# Altium project LightLink_V3.PrjPcb
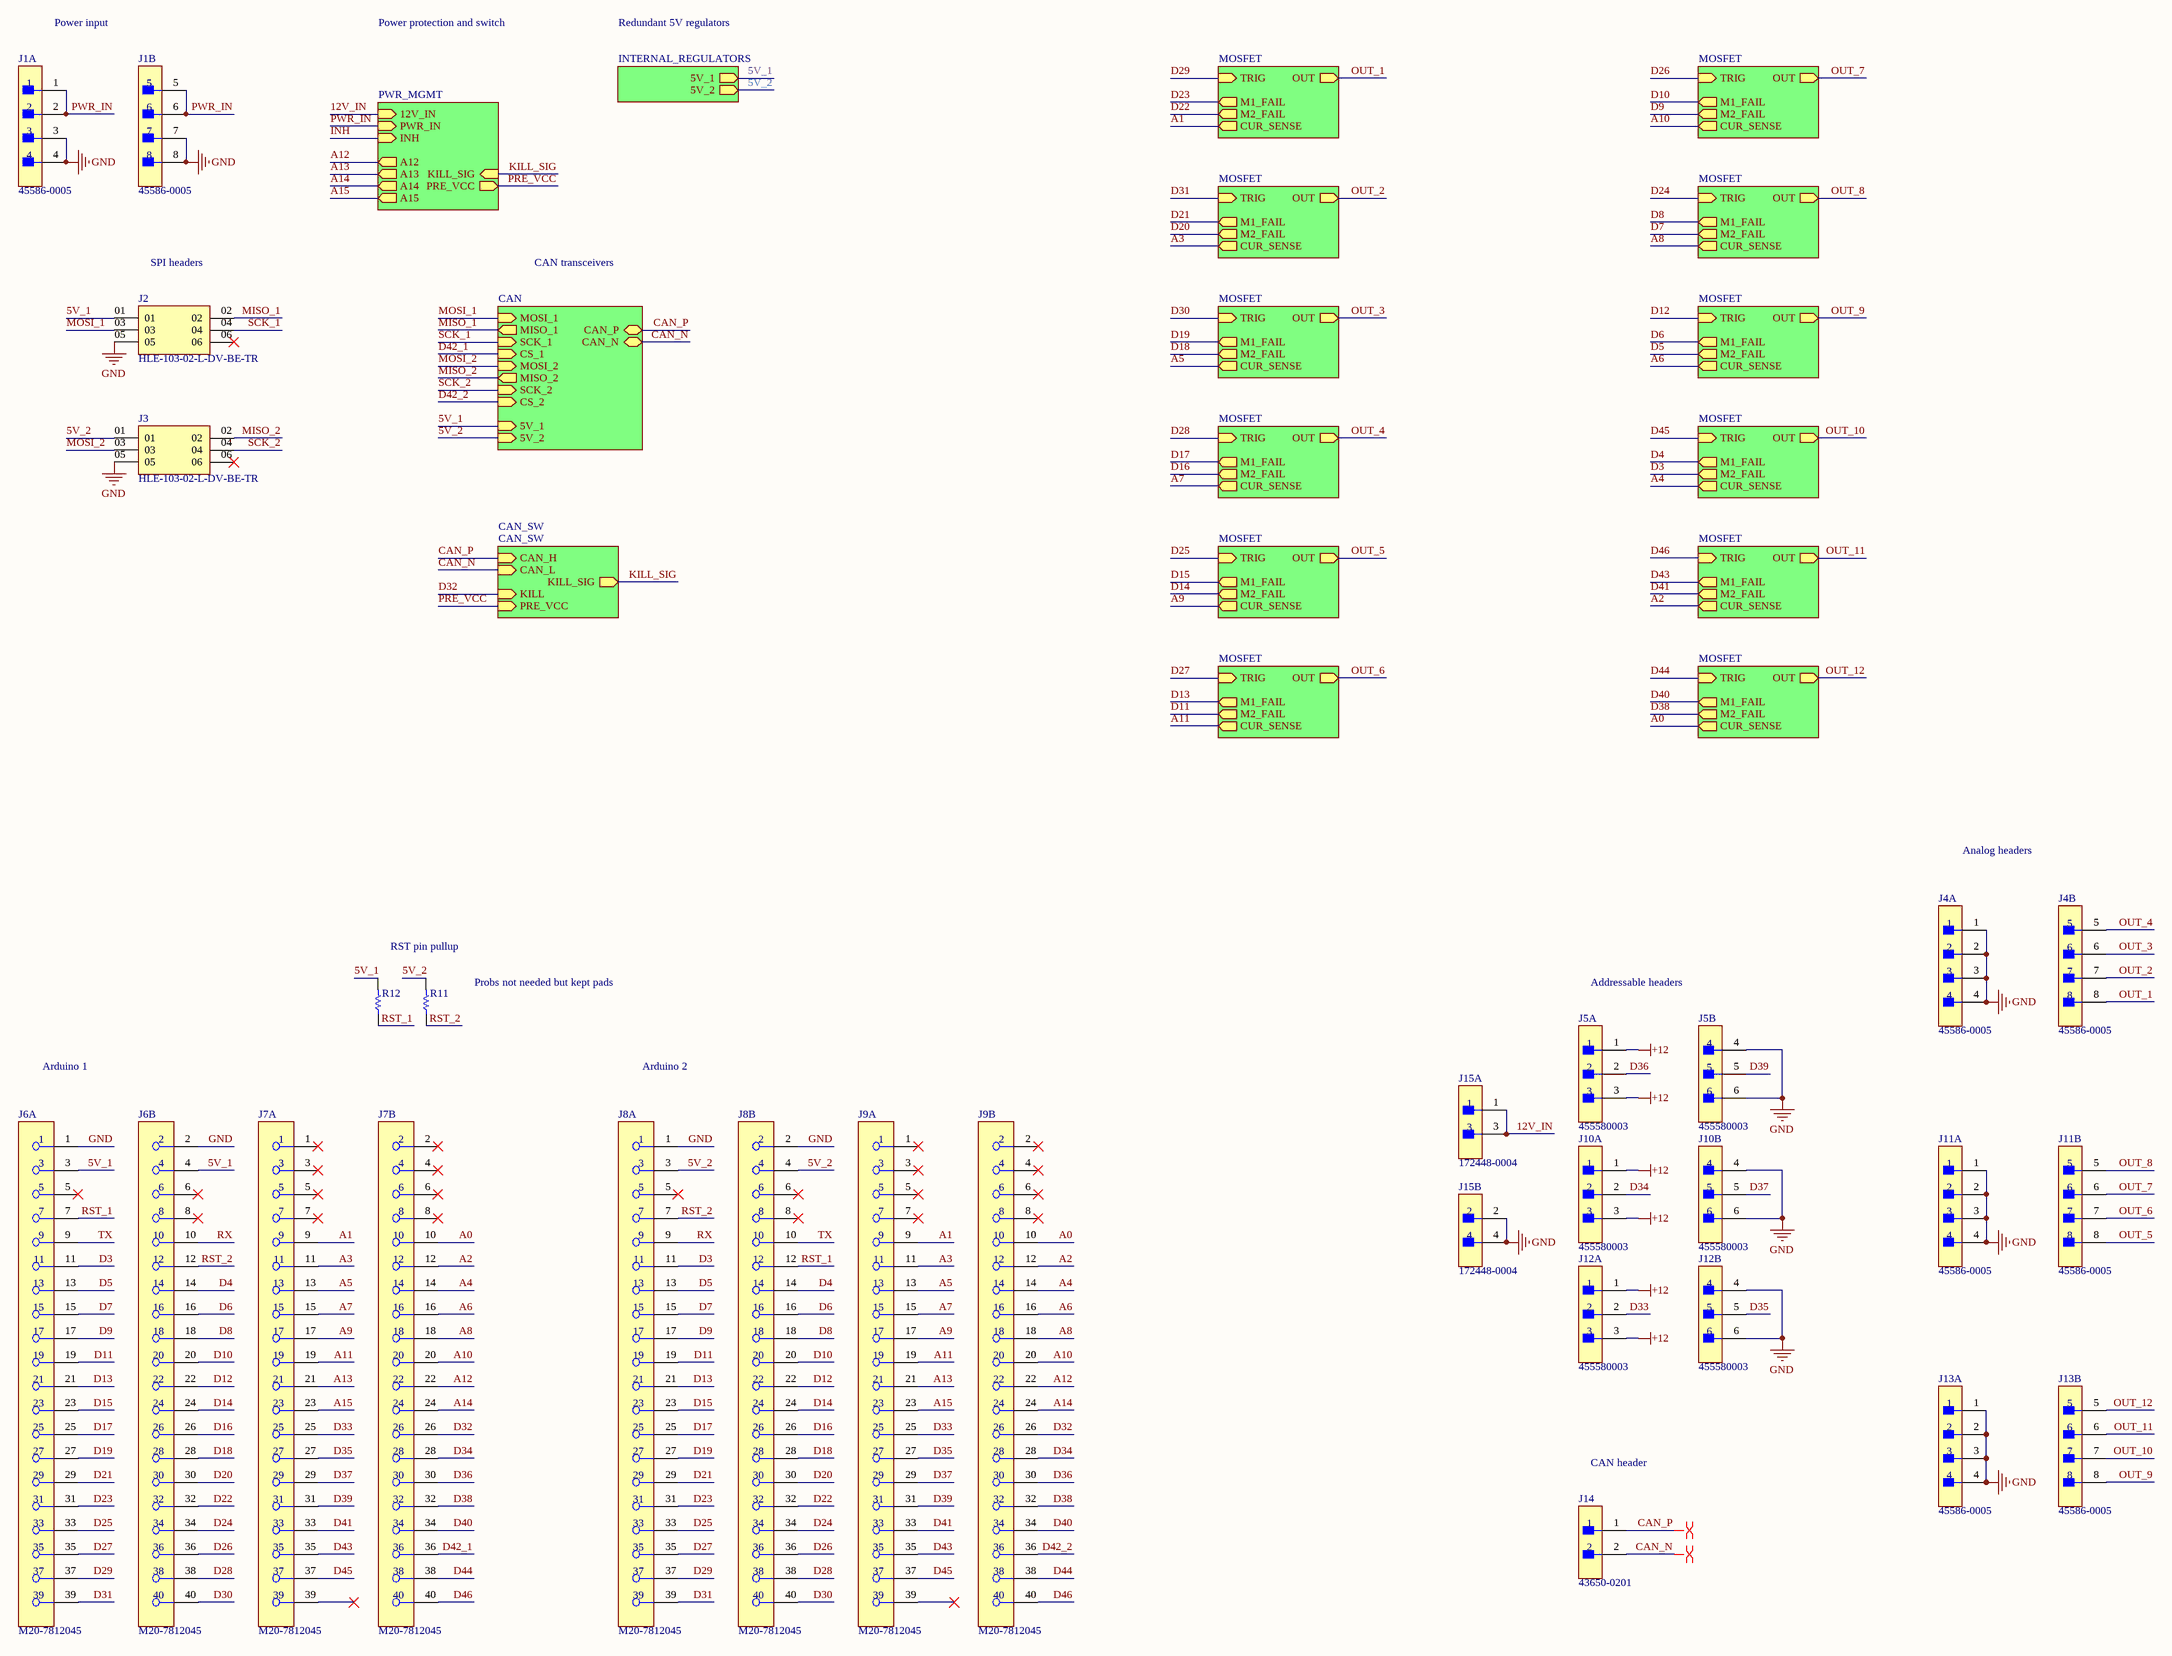
[diagram p0: LightLink_V3.SchDoc]
5 sheets, 346 parts. Net scope: hierarchical (ports join the sheet entries above them; power ports are global).
Board file: LightLink_V3.PcbDoc
Sheets:
  LightLink_V3.SchDoc
    M = MOSFET.SchDoc
    M = MOSFET.SchDoc
    M = MOSFET.SchDoc
    M = MOSFET.SchDoc
    M = MOSFET.SchDoc
    M = MOSFET.SchDoc
    M = MOSFET.SchDoc
    M = MOSFET.SchDoc
    M = MOSFET.SchDoc
    M = MOSFET.SchDoc
    M = MOSFET.SchDoc
    M = MOSFET.SchDoc
    CAN = CAN.SchDoc
    INTERNAL_REGULATORS = INTERNAL_REGULATORS.SchDoc
    CAN_SW = CAN_SW.SchDoc

## Sheet LightLink_V3.SchDoc
size C; SheetNumber: 1; SheetTotal: 6

### Parts
J1  45586-0005  [FP-45586-0005-MFG]  (parts A,B of 2)
J2  HLE-103-02-L-DV-BE-TR  [SAMTEC_HLE-103-02-L-DV-BE-TR]
J3  HLE-103-02-L-DV-BE-TR  [SAMTEC_HLE-103-02-L-DV-BE-TR]
J4  45586-0005  [FP-45586-0005-MFG]  (parts A,B of 2)
J5  455580003  [FP-455580003-MFG]  (parts A,B of 2)
J6  M20-7812045  [FP-M20-7812045-MFG]  (parts A,B of 2)
J7  M20-7812045  [FP-M20-7812045-MFG]  (parts A,B of 2)
J8  M20-7812045  [FP-M20-7812045-MFG]  (parts A,B of 2)
J9  M20-7812045  [FP-M20-7812045-MFG]  (parts A,B of 2)
J10  455580003  [FP-455580003-MFG]  (parts A,B of 2)
J11  45586-0005  [FP-45586-0005-MFG]  (parts A,B of 2)
J12  455580003  [FP-455580003-MFG]  (parts A,B of 2)
J13  45586-0005  [FP-45586-0005-MFG]  (parts A,B of 2)
J14  43650-0201  [FP-43650-0201-MFG]
J15  172448-0004  [FP-39-30-1041-MFG]  (parts A,B of 2)
R11  ERJ3EKF1002V  [RESC1609X55X30LL15T15]  (value not drawn)
R12  ERJ3EKF1002V  [RESC1609X55X30LL15T15]  (value not drawn)

### Sub-sheets
CAN = CAN: CAN_P (bidir), CAN_N (bidir), CS_1 (in), CS_2 (in), MOSI_1 (in), MISO_1 (out), SCK_1 (in), MOSI_2 (in), MISO_2 (out), SCK_2 (in), 5V_1 (in), 5V_2 (in)
CAN_SW = CAN_SW: CAN_H (in), CAN_L (in), KILL (in), KILL_SIG (out), PRE_VCC (in)
INTERNAL_REGULATORS = INTERNAL_REGULATORS: 5V_1 (out), 5V_2 (out)
M = MOSFET: TRIG (in), OUT (out), M2_FAIL (out), M1_FAIL (out), CUR_SENSE (out)
M = MOSFET: TRIG (in), OUT (out), M2_FAIL (out), M1_FAIL (out), CUR_SENSE (out)
M = MOSFET: TRIG (in), OUT (out), M2_FAIL (out), M1_FAIL (out), CUR_SENSE (out)
M = MOSFET: TRIG (in), OUT (out), M2_FAIL (out), M1_FAIL (out), CUR_SENSE (out)
M = MOSFET: TRIG (in), OUT (out), M2_FAIL (out), M1_FAIL (out), CUR_SENSE (out)
M = MOSFET: TRIG (in), OUT (out), M2_FAIL (out), M1_FAIL (out), CUR_SENSE (out)
M = MOSFET: TRIG (in), OUT (out), M2_FAIL (out), M1_FAIL (out), CUR_SENSE (out)
M = MOSFET: TRIG (in), OUT (out), M2_FAIL (out), M1_FAIL (out), CUR_SENSE (out)
M = MOSFET: TRIG (in), OUT (out), M2_FAIL (out), M1_FAIL (out), CUR_SENSE (out)
M = MOSFET: TRIG (in), OUT (out), M2_FAIL (out), M1_FAIL (out), CUR_SENSE (out)
M = MOSFET: TRIG (in), OUT (out), M2_FAIL (out), M1_FAIL (out), CUR_SENSE (out)
M = MOSFET: TRIG (in), OUT (out), M2_FAIL (out), M1_FAIL (out), CUR_SENSE (out)
PWR_MGMT = PWR_MGMT (file not in this document): PWR_IN (in), INH (in), A13 (out), A12 (out), PRE_VCC (out), KILL_SIG (in), A14 (out), A15 (out), 12V_IN (in)

### Nets
+12: J5.1 J5.3 J10.1 J10.3 J12.1 J12.3
GND: J1.3 J1.4 J1.7 J1.8 J2.05 J3.05 J4.1 J4.2 J4.3 J4.4 J5.4 J5.6 J6.1 J6.2 J8.1 J8.2 J10.4 J10.6 J11.1 J11.2 J11.3 J11.4 J12.4 J12.6 J13.1 J13.2 J13.3 J13.4 J15.2 J15.4
5V_1: J2.01 J6.3 J6.4 R12.2 ; sheet CAN/5V_1, sheet INTERNAL_REGULATORS/5V_1
5V_2: J3.01 J8.3 J8.4 R11.2 ; sheet CAN/5V_2, sheet INTERNAL_REGULATORS/5V_2
12V_IN: J15.1 J15.3 ; sheet PWR_MGMT/12V_IN
A0: J7.10 J9.10 ; sheet M/CUR_SENSE
A1: J7.9 J9.9 ; sheet M/CUR_SENSE
A2: J7.12 J9.12 ; sheet M/CUR_SENSE
A3: J7.11 J9.11 ; sheet M/CUR_SENSE
A4: J7.14 J9.14 ; sheet M/CUR_SENSE
A5: J7.13 J9.13 ; sheet M/CUR_SENSE
A6: J7.16 J9.16 ; sheet M/CUR_SENSE
A7: J7.15 J9.15 ; sheet M/CUR_SENSE
A8: J7.18 J9.18 ; sheet M/CUR_SENSE
A9: J7.17 J9.17 ; sheet M/CUR_SENSE
A10: J7.20 J9.20 ; sheet M/CUR_SENSE
A11: J7.19 J9.19 ; sheet M/CUR_SENSE
A12: J7.22 J9.22 ; sheet PWR_MGMT/A12
A13: J7.21 J9.21 ; sheet PWR_MGMT/A13
A14: J7.24 J9.24 ; sheet PWR_MGMT/A14
A15: J7.23 J9.23 ; sheet PWR_MGMT/A15
CAN_N: J14.2 ; sheet CAN/CAN_N, sheet CAN_SW/CAN_L
CAN_P: J14.1 ; sheet CAN/CAN_P, sheet CAN_SW/CAN_H
D3: J6.11 J8.11 ; sheet M/M2_FAIL
D4: J6.14 J8.14 ; sheet M/M1_FAIL
D5: J6.13 J8.13 ; sheet M/M2_FAIL
D6: J6.16 J8.16 ; sheet M/M1_FAIL
D7: J6.15 J8.15 ; sheet M/M2_FAIL
D8: J6.18 J8.18 ; sheet M/M1_FAIL
D9: J6.17 J8.17 ; sheet M/M2_FAIL
D10: J6.20 J8.20 ; sheet M/M1_FAIL
D11: J6.19 J8.19 ; sheet M/M2_FAIL
D12: J6.22 J8.22 ; sheet M/TRIG
D13: J6.21 J8.21 ; sheet M/M1_FAIL
D14: J6.24 J8.24 ; sheet M/M2_FAIL
D15: J6.23 J8.23 ; sheet M/M1_FAIL
D16: J6.26 J8.26 ; sheet M/M2_FAIL
D17: J6.25 J8.25 ; sheet M/M1_FAIL
D18: J6.28 J8.28 ; sheet M/M2_FAIL
D19: J6.27 J8.27 ; sheet M/M1_FAIL
D20: J6.30 J8.30 ; sheet M/M2_FAIL
D21: J6.29 J8.29 ; sheet M/M1_FAIL
D22: J6.32 J8.32 ; sheet M/M2_FAIL
D23: J6.31 J8.31 ; sheet M/M1_FAIL
D24: J6.34 J8.34 ; sheet M/TRIG
D25: J6.33 J8.33 ; sheet M/TRIG
D26: J6.36 J8.36 ; sheet M/TRIG
D27: J6.35 J8.35 ; sheet M/TRIG
D28: J6.38 J8.38 ; sheet M/TRIG
D29: J6.37 J8.37 ; sheet M/TRIG
D30: J6.40 J8.40 ; sheet M/TRIG
D31: J6.39 J8.39 ; sheet M/TRIG
D32: J7.26 J9.26 ; sheet CAN_SW/KILL
D33: J7.25 J9.25 J12.2
D34: J7.28 J9.28 J10.2
D35: J7.27 J9.27 J12.5
D36: J5.2 J7.30 J9.30
D37: J7.29 J9.29 J10.5
D38: J7.32 J9.32 ; sheet M/M2_FAIL
D39: J5.5 J7.31 J9.31
D40: J7.34 J9.34 ; sheet M/M1_FAIL
D41: J7.33 J9.33 ; sheet M/M2_FAIL
D42_1: J7.36 ; sheet CAN/CS_1  [project net CS_1]
D42_2: J9.36 ; sheet CAN/CS_2  [project net CS_2]
D43: J7.35 J9.35 ; sheet M/M1_FAIL
D44: J7.38 J9.38 ; sheet M/TRIG
D45: J7.37 J9.37 ; sheet M/TRIG
D46: J7.40 J9.40 ; sheet M/TRIG
INH: sheet PWR_MGMT/INH
KILL_SIG: sheet PWR_MGMT/KILL_SIG, sheet CAN_SW/KILL_SIG
MISO_1: J2.02 ; sheet CAN/MISO_1
MISO_2: J3.02 ; sheet CAN/MISO_2
MOSI_1: J2.03 ; sheet CAN/MOSI_1
MOSI_2: J3.03 ; sheet CAN/MOSI_2
OUT_1: J4.8 ; sheet M/OUT
OUT_2: J4.7 ; sheet M/OUT
OUT_3: J4.6 ; sheet M/OUT
OUT_4: J4.5 ; sheet M/OUT
OUT_5: J11.8 ; sheet M/OUT
OUT_6: J11.7 ; sheet M/OUT
OUT_7: J11.6 ; sheet M/OUT
OUT_8: J11.5 ; sheet M/OUT
OUT_9: J13.8 ; sheet M/OUT
OUT_10: J13.7 ; sheet M/OUT
OUT_11: J13.6 ; sheet M/OUT
OUT_12: J13.5 ; sheet M/OUT
PRE_VCC: sheet PWR_MGMT/PRE_VCC, sheet CAN_SW/PRE_VCC
PWR_IN: J1.1 J1.2 J1.5 J1.6 ; sheet PWR_MGMT/PWR_IN
RST_1: J6.7 J8.12 R12.1
RST_2: J6.12 J8.7 R11.1
RX: J6.10 J8.9
SCK_1: J2.04 ; sheet CAN/SCK_1
SCK_2: J3.04 ; sheet CAN/SCK_2
TX: J6.9 J8.10

Not connected (* = marked no-connect by the designer): J2 06*; J3 06*; J6 5* 6* 8*; J7 1* 2* 3* 4* 5* 6* 7* 8* 39*; J8 5* 6* 8*; J9 1* 2* 3* 4* 5* 6* 7* 8* 39*

### Layout directives
differential pair: CAN_N, CAN_P

### Notes on the sheet
- Power input
- Power protection and switch
- Redundant 5V regulators
- SPI headers
- CAN transceivers
- Analog headers
- RST pin pullup
- Probs not needed but kept pads
- Addressable headers
- Arduino 1
- Arduino 2
- CAN header

### Library data of the parts
J1 J4 J11 J13 = CMP-04776-000690-1: CONN HEADER R/A 8POS 4.2MM
J2 J3 = CMP-020-000000-2: MF: Samtec; Availability: Unavailable; Package: None; Component Type: Standard; MP: HLE-103-02-L-DV-BE-TR; Pin Count: 6; Design Item ID: HLE-103-02-L-DV-BE-TR; Value: *; Price: None; Source: HLE-103-02-L-DV-BE-TR.SchLib
J5 J10 J12 = CMP-04776-000024-1: CONN HEADER R/A 6POS 4.2MM; Manufacturer: Molex; Standoff Height: 0.4mm; Conn Orientation: Right Angle; Number Of Contacts: 6; Conn Gender: Male; Voltage Rating: 600V; Current Rating: 8A; Footprint Url: https://www.molex.com/pdm_docs/sd/455580003_sd.pdf; Number Of Rows: 2; Lead Free: Yes; Digikey Description: CONN HEADER R/A 6POS 4.2MM; ComponentLink2URL: https://www.molex.com/webdocs/datasheets/pdf/en-us/0455580003_PCB_HEADERS.pdf; Octopart: https://octopart.com/45558-0003-molex-7672845; Package: 0; Device Class L3: unset; ComponentLink2Description: Datasheet; Device Class L2: Headers and Wire Housings; Category: Conn; Contact Material: Tin,Nickel; Mouser Description: Conn Power HDR 6 POS 4.2mm Solder ST Thru-Hole 6 Terminal 1 Port Mini-Fit Jr™ Tray; Manufacturer Part Number: 455580003; Pitch: 4.2mm; Device Class L1: Connectors; Temperature Range Low: -40°C; Temperature: -40°C to +105°C; RoHS: TRUE; Temperature Range High: +105°C; Height: 10.38mm; Automotive: No
J6-J9 = CMP-15831-000026-1: CONN RCPT 40POS 0.1 GOLD SMD; Current Rating: 3A; Number of Positions: 40; Connector Type: Receptacle; Max Operating Temperature: 105°C; Flammability Rating: UL94 V-0; Contact Material: Bronze; Number of Rows: 2; Fastening Type: Push; Insulation Color: Black; Mount: Surface Mount; Contact Shape: Square; Termination: Solder; Packaging: Rail/Tube; Contact Plating: Gold; Min Operating Temperature: -40°C; Insulation Material: Nylon
J14 = CMP-04776-000557-1: CONN HEADER R/A 2POS 3MM; Voltage Rating: 600V; Number of Circuits: 2; Insulation Resistance: 1GR; Current Rating: 5A; Voltage Rating (DC): 250V; Contact Resistance: 10mR; Gender: Male; Number of Ports: 1; Glow Wire Compliant: Compliant; Pitch: 3mm; Contact Plating: Gold; Series: 43650; Color: Black; Max Operating Temperature: 105°C; Radiation Hardening: No; Orientation: Right Angle; Number of Terminals/Pins: 2; Length: 9.65mm; Case/Package: 0201; Halogen Free: Low Halogen; Housing Color: Black; Min Operating Temperature: -40°C; Package Quantity: 3927; Contact Material: Brass; Number of Rows: 1; Number of Positions: 2; Termination: Solder; Depth: 9.9mm; Mount: Through Hole; Packaging: Tray; Number of Contacts: 2; Housing Material: Thermoplastic; Flammability Rating: UL94 V-0
J15 = CMP-04776-000047-1: Different component but holes should line up. Original P/N is 39-30-1041; Manufacturer: Molex; Old_Part_Number: 5569-04A2G; Keying_to_Mating_Part: None; Circuits_maximum: 4; First_Mate__Last_Break: No; Lead_freeProcess_Capability: WAVE; Duration_at_Max_Process_Temperature_seconds: 005; Sales_Drawing: SDA-5569-NA2*-*; Current Rating: 13A; Material___Plating_Mating: Gold; Conn Gender: Male; Test_Summary: TS-5556-002; Color___Resin: Natural; Termination_Interface_Style: Through Hole; Pitch___Termination_Interface: 4.20mm; UL: E29179; PCB_Retention: Yes; Product_Name: Mini-Fit Jr.TM; Material___Resin: Nylon; Overview: Mini-Fit Jr. Power Connectors; CSA: LR19980; Plating_min___Termination: 2.540μm; Packaging_Type: Bag; Number_of_Rows: 2; Durability_mating_cycles_max: 30; Max_Cycles_at_Max_Process_Temperature: 001; Product_Specification: PS-45750-001, PS-5556-001; Net_Weight: 1.529/g; Voltage___Maximum: 600V; Material___Metal: Brass; Pitch: 4.2mm; Packaging_Specification: PK-5569-002; Shrouded: Fully; Plating_min___Mating: 0.762μm; Temperature_Range___Operating: -40°C to +105°C; Current___Maximum_per_Contact: 13.0A; Comments: Current = 13A max. per circuit when header is mated to a receptacle loaded with  45750  Mini-Fit® Plus HCS Crimp Terminal Crimped to 16 AWG wire.,  See Molex Product specification PS-5556-001 for additional current de-rating information.; Process_Temperature_max_C: 240; PCB_Thickness___Recommended: 1.78mm; Standoff Height: 0.016inch; Surface_Mount_Compatible_SMC: No; UPC: 800753579651; Conn Orientation: Right Angle; Material___Plating_Termination: Matte Tin; ComponentLink2Description: Datasheet; Footprint Url: https://www.molex.com/pdm_docs/sd/039301041_sd.pdf; Contact Material: Gold,Nickel; Octopart: https://octopart.com/39-30-1041-molex-276737; Digikey Description: CONN HEADER R/A 4POS 4.2MM; imported: yes; Series: 5569; Mouser Description: Headers & Wire Housings 4 CKT R/A HEADER; Temperature Range High: +105°C; Category: Conn; Polarized_to_Mating_Part: Yes; Pitch___Mating_Interface: 4.20mm; Automotive: No; Guide_to_Mating_Part: No; Lock_to_Mating_Part: Yes; Number Of Contacts: 4; Temperature Range Low: -40°C; RoHS: TRUE; Status: Active; imported_from: 3D Model; ComponentLink2URL: http://www.molex.com/pdm_docs/sd/039301041_sd.pdf; part_page: http://www.molex.com/molex/products/datasheet.jsp?part=active/0039301041_PCB_HEADERS.xml; Temperature: -40°C to +105°C; Device Class L3: unset; Device Class L1: Connectors; Package: 39-30-1041; Circuits_Loaded: 4; Lead Free: Yes; Ipc Land Pattern Name: CAPAD1016W80L630D240; Application: Power, Wire-to-Board; Voltage Rating: 600V; Manufacturer Part Number: 39-30-1041; Breakaway: No; Orientation: Right Angle; Flammability: 94V-2; 3D_model: http://www.molex.com/pdm_docs/stp/39-30-1041_stp.zip; Number Of Rows: 2; Polarized_to_PCB: Yes; Device Class L2: Headers and Wire Housings; Glow_Wire_Compliant: No; Stackable: No; PCB_Locator: Yes
R11 R12 = CMP-1012-00623-3: Chip Resistor, 10 KOhm, +/- 1%, 0.1 W, -55 to 155 degC, 0603 (1608 Metric), RoHS, Tape and Reel; Manufacturer: Panasonic; Voltage Rating: 75V; Case\/Package: 0603; Power Rating: 100mW; Resistance: 10KOhm; Temperature Coefficient: 100ppm\/degreesC; Number of Pins: 2; Package Reference: 603; Depth: 0.8mm; Mount: SurfaceMount; Package Description: 2-Pin Surface Mount Device, Body 1.6 x 0.85 mm; Datasheet Version: 02/2017; Length: 1.6mm; Lead Free: LeadFree; Height: 0.45mm; Number of Terminations: 2; Max Power Dissipation: 100mW; Min Operating Temperature: -55degC; Datasheet URL: https://industrial.panasonic.com/cdbs/www-data/pdf/RDA0000/AOA0000C304.pdf; Termination: SMD/SMT; Case Code (Metric): 1608; Case Code (Imperial): 0603; Tolerance: 1%; Max Operating Temperature: 155degC; RoHSCompliant: true; Voltage Rating (DC): 75V; Radiation Hardening: No; Packaging: TapeandReel; Composition: ThickFilm; Mounting Technology: SurfaceMount; Manufacturer URL: http://www.panasonic.com/; Width: 0.031inch; REACH SVHC: NoSVHC; Contact Plating: Tin; Military Standard: Not; Package Quantity: 1

## Sheet MOSFET.SchDoc
size B; SheetNumber: 2; SheetTotal: 6
Used 12 times, as channels M, M, M, M, M, M, M, M, M, M, M, M. Parts and nets are listed once, with the designators drawn on the sheet.
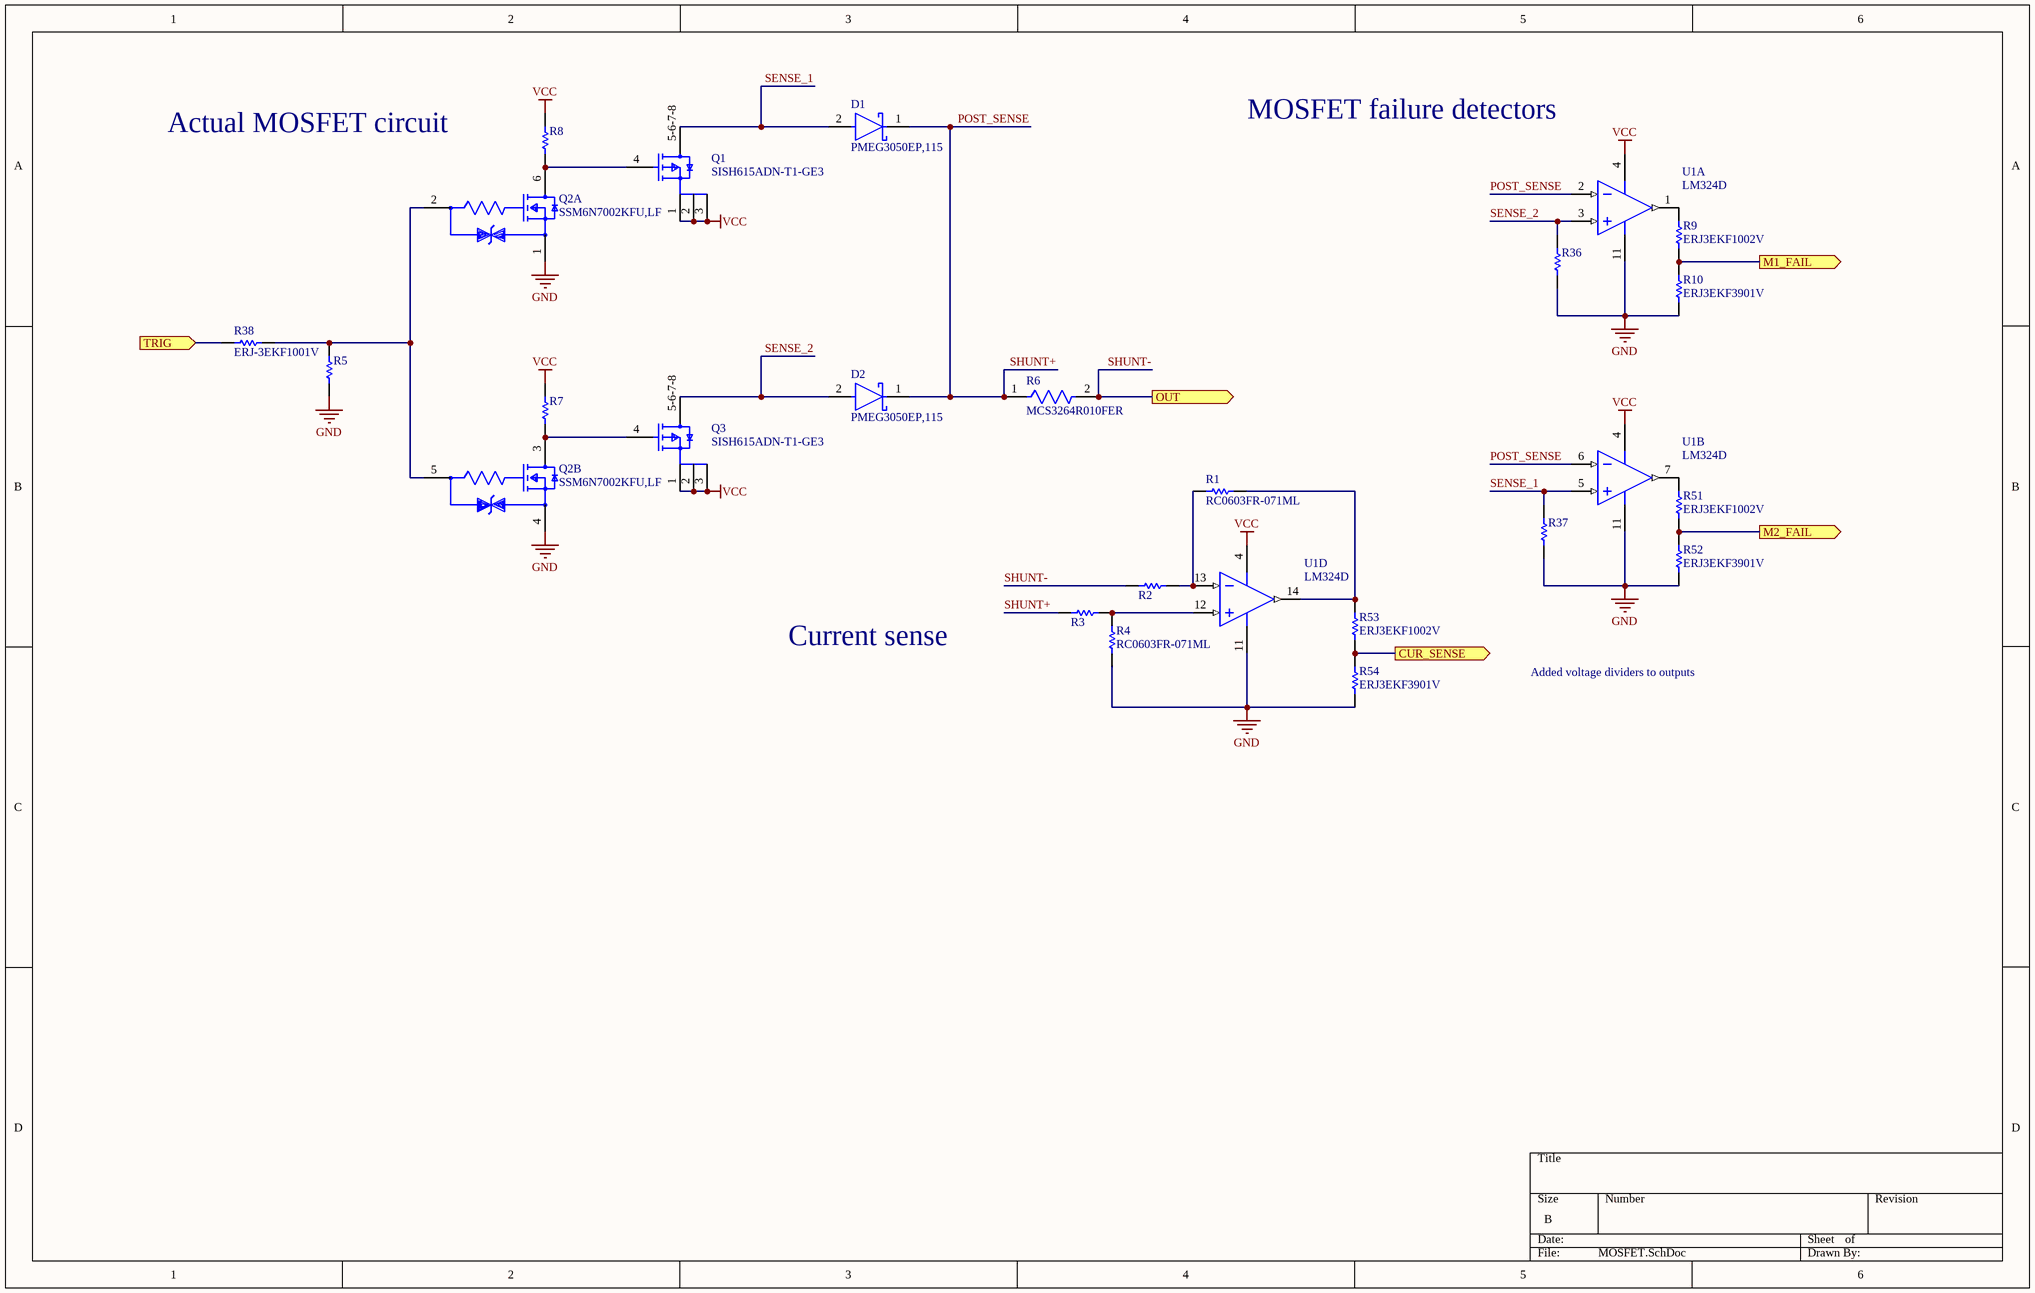
[diagram p1: MOSFET.SchDoc]

### Parts
D1  PMEG3050EP,115  [FP-SOD128-MFG]
D2  PMEG3050EP,115  [FP-SOD128-MFG]
Q1  SISH615ADN-T1-GE3  [SISH615ADN-T1-GE3-Footprint-1]
Q2  SSM6N7002KFU,LF  [FP-SSOP6-P-0_65A-MFG]  (parts A,B of 2)
Q3  SISH615ADN-T1-GE3  [SISH615ADN-T1-GE3-Footprint-1]
R1  RC0603FR-071ML  [RESC1608X55X25LL10T15]
R2  ERJ3EKF1002V  [RESC1609X55X30LL15T15]  (value not drawn)
R3  ERJ3EKF1002V  [RESC1609X55X30LL15T15]  (value not drawn)
R4  RC0603FR-071ML  [RESC1608X55X25LL10T15]
R5  ERJ3EKF1002V  [RESC1609X55X30LL15T15]  (value not drawn)
R6  MCS3264R010FER  [FP-MCS3264-MFG]
R7  ERJ3EKF1002V  [RESC1609X55X30LL15T15]  (value not drawn)
R8  ERJ3EKF1002V  [RESC1609X55X30LL15T15]  (value not drawn)
R9  ERJ3EKF1002V  [RESC1609X55X30LL15T15]
R10  ERJ3EKF3901V  [RESC1608X55X30ML15T15]
R36  ERJ-3EKF1003V  [RESC1608X55X30ML15T15]  (value not drawn)
R37  ERJ-3EKF1003V  [RESC1608X55X30ML15T15]  (value not drawn)
R38  ERJ-3EKF1001V  [RESC1608X55X30LL15T15]
R51  ERJ3EKF1002V  [RESC1609X55X30LL15T15]
R52  ERJ3EKF3901V  [RESC1608X55X30ML15T15]
R53  ERJ3EKF1002V  [RESC1609X55X30LL15T15]
R54  ERJ3EKF3901V  [RESC1608X55X30ML15T15]
U1  LM324D  [D0014A_L]  (parts A,B,D of 4)

### Ports
CUR_SENSE (out, see LightLink_V3[5A]), M1_FAIL (out, see LightLink_V3[5A]), M2_FAIL (out, see LightLink_V3[5A]), OUT (out, see LightLink_V3[5A]), TRIG (in, see LightLink_V3[5A])

### Nets
GND: Q2.1(Source1) Q2.4(Source2) R4.1 R5.1 R10.1 R36.1 R37.1 R52.1 R54.1 U1.11(GND)
VCC: Q1.1(S) Q1.2(S) Q1.3(S) Q3.1(S) Q3.2(S) Q3.3(S) R7.2 R8.2 U1.4(VCC)
CUR_SENSE: R53.1 R54.2 ; port CUR_SENSE
M1_FAIL: R9.1 R10.2 ; port M1_FAIL
M2_FAIL: R51.1 R52.2 ; port M2_FAIL
POST_SENSE: D1.1(C) D2.1(C) R3.2 R6.1 U1.2(1IN-) U1.6(2IN-)  [also labelled SHUNT+]
SENSE_1: D1.2(A) Q1.5-6-7-8(D) R37.2 U1.5(2IN+)
SENSE_2: D2.2(A) Q3.5-6-7-8(D) R36.2 U1.3(1IN+)
SHUNT-: R2.2 R6.2 ; port OUT
TRIG: R38.1 ; port TRIG
NetQ1_4: Q1.4(G) Q2.6(Drain1) R8.1
NetQ2_2: Q2.2(Gate1) Q2.5(Gate2) R5.2 R38.2
NetQ2_3: Q2.3(Drain2) Q3.4(G) R7.1
NetR1_1: R1.1 R2.1 U1.13(4IN-)
NetR1_2: R1.2 R53.2 U1.14(4OUT)
NetR3_1: R3.1 R4.2 U1.12(4IN+)
NetR9_2: R9.2 U1.1(1OUT)
NetR51_2: R51.2 U1.7(2OUT)

### Channels
M: designators end in _M#1; ports CUR_SENSE=A1 M1_FAIL=D23 M2_FAIL=D22 OUT=OUT_1 TRIG=D29
M: designators end in _M#2; ports CUR_SENSE=A3 M1_FAIL=D21 M2_FAIL=D20 OUT=OUT_2 TRIG=D31
M: designators end in _M#3; ports CUR_SENSE=A5 M1_FAIL=D19 M2_FAIL=D18 OUT=OUT_3 TRIG=D30
M: designators end in _M#4; ports CUR_SENSE=A7 M1_FAIL=D17 M2_FAIL=D16 OUT=OUT_4 TRIG=D28
M: designators end in _M#5; ports CUR_SENSE=A9 M1_FAIL=D15 M2_FAIL=D14 OUT=OUT_5 TRIG=D25
M: designators end in _M#6; ports CUR_SENSE=A11 M1_FAIL=D13 M2_FAIL=D11 OUT=OUT_6 TRIG=D27
M: designators end in _M#7; ports CUR_SENSE=A10 M1_FAIL=D10 M2_FAIL=D9 OUT=OUT_7 TRIG=D26
M: designators end in _M#8; ports CUR_SENSE=A8 M1_FAIL=D8 M2_FAIL=D7 OUT=OUT_8 TRIG=D24
M: designators end in _M#9; ports CUR_SENSE=A6 M1_FAIL=D6 M2_FAIL=D5 OUT=OUT_9 TRIG=D12
M: designators end in _M#10; ports CUR_SENSE=A4 M1_FAIL=D4 M2_FAIL=D3 OUT=OUT_10 TRIG=D45
M: designators end in _M#11; ports CUR_SENSE=A2 M1_FAIL=D43 M2_FAIL=D41 OUT=OUT_11 TRIG=D46
M: designators end in _M#12; ports CUR_SENSE=A0 M1_FAIL=D40 M2_FAIL=D38 OUT=OUT_12 TRIG=D44

### Notes on the sheet
- Actual MOSFET circuit
- MOSFET failure detectors
- Current sense
- Added voltage dividers to outputs

### Library data of the parts
D1 D2 = CMP-14398-000051-1: DIODE SCHOTTKY 30V 5A SOD128; RoHS Compliant: Yes
Q1 Q3 = CMP-013-00036-2: Trans MOSFET P-CH 20V 22.1A 8-Pin PowerPAK 1212 EP T/R
Q2 = CMP-35916-000009-1: MOSFET 2N-CH 60V 0.3A; Input Capacitance: 40pF; Continuous Drain Current (ID): 300mA; Max Power Dissipation: 285mW; FET Type: 2 N-Channel; Rds On Max: 1.5R; Mount: Surface Mount; Drain to Source Voltage (Vdss): 60V; Packaging: Tape and Reel
R1 R4 = CMP-1659-00056-1: Chip Resistor, 1 MOhm, +/- 1%, 100 mW, -55 to 155 degC, 0603 (1608 Metric), RoHS, Tape and Reel; Voltage Rating (DC): 25 V; Tolerance: 20%; Case\Package: Radial; Capacitance: 1 mF; Min Operating Temperature: -40 degC; PackageDescription: 2-Pin Surface Mount Device, Body 1.6 x 0.8 mm; ComponentLink1Description: Manufacturer URL; Radiation Hardening: No; DatasheetVersion: Rev. 4, 02/2016; REACH SVHC: No SVHC; Length: 20 mm; Max Operating Temperature: 85 degC; Diameter: 10 mm; Packaging: Bulk; Package Quantity: 200; PackageReference: 0603; Mount: Through Hole; ComponentLink1URL: http://www.yageo.com/; ComponentLink2URL: http://www.yageo.com/documents/recent/PYu-RC_Group_51_RoHS_L_04.pdf; ComponentLink2Description: Datasheet; Width: 0 inch; Lead Pitch: 5 mm; RoHSCompliant: true; Voltage Rating: 25 V; Height: 20 mm
R2 R3 R5 R7-R9 R51 R53 = CMP-1012-00623-3: as R11 on sheet LightLink_V3; Number of Pins: 2; Package Reference: 603; Depth: 0.8mm; Mount: SurfaceMount; Package Description: 2-Pin Surface Mount Device, Body 1.6 x 0.85 mm; Datasheet Version: 02/2017; Length: 1.6mm; Lead Free: LeadFree; Height: 0.45mm; Number of Terminations: 2; Max Power Dissipation: 100mW; Min Operating Temperature: -55degC; Datasheet URL: https://industrial.panasonic.com/cdbs/www-data/pdf/RDA0000/AOA0000C304.pdf; Termination: SMD/SMT; Case Code (Metric): 1608; Case Code (Imperial): 0603; Tolerance: 1%; Max Operating Temperature: 155degC; RoHSCompliant: true; Voltage Rating (DC): 75V; Radiation Hardening: No; Packaging: TapeandReel; Composition: ThickFilm; Mounting Technology: SurfaceMount; Manufacturer URL: http://www.panasonic.com/; Width: 0.031inch; REACH SVHC: NoSVHC; Contact Plating: Tin; Military Standard: Not; Package Quantity: 1
R6 = CMP-33361-000012-1: RES SMD 10 MOHM 1% 2W 3264; Temperature Coefficient: 50ppm/°C; Resistance: 10mR; Voltage Rating: 220mV; Case/Package: 2512; Military Standard: Not; Max Operating Temperature: 150°C; Height: 0.024inch; Package Quantity: 1; Case Code (Imperial): 2512; Number of Terminations: 2; Features: Flame Retardant Coating; Width: 0.126inch; Tolerance: 1%; Composition: Metal Element; Number of Pins: 2; Packaging: Tape and Reel; Depth: 3.2mm; Termination: SMD/SMT; Min Operating Temperature: -55°C; Power Rating: 2W; Case Code (Metric): 6432; Max Power Dissipation: 2W; Mount: Surface Mount; Length: 6.4mm
R10 R52 R54 = CMP-2000-00475-1: Manufacturer: Panasonic; Part Number: ERJ3EKF3901V
R36 R37 = CMP-2000-00182-1: Manufacturer: Panasonic; Part Number: ERJ-3EKF1003V
R38 = CMP-2000-00180-1: Manufacturer: Panasonic; Part Number: ERJ-3EKF1001V
U1 = CMP-2000-06547-1: Quadruple Operational Amplifier, 0.5 V/us, 1.2 MHz, 3 to 32 V, 0 to 70 degC, 14-Pin SOIC (D), Green (RoHS & no Sb/Br), Tube; Manufacturer: Texas Instruments; Unity Gain Bandwidth Product: 1.2MHz; Input Offset Voltage: 7mV; Dual Supply Voltage (Max): ±16V; Single Supply Voltage (Min): 3V; Single Supply Voltage (Max): 32V; Voltage Gain in dB: 100dB; Power Supply Requirement: Single/Dual; Input Bias Current: 250nA; Dual Supply Voltage (Min): ±1.5V; Single Supply Voltage (Typ): 5/9/12/15/18/24/28V; Dual Supply Voltage (Typ): ±3/±5/±9/±12/±15V; Number of  Elements: 4; Common Mode Rejection Ratio: 65dB; Datasheet Version: Rev. W, 03/2015; Technology: Bipolar; Shut Down Feature: No; Package Reference: D0014A; Type: GeneralPurposeAmplifier; Pin Count: 14; Package Type: SOIC; Rail/Rail I/O Type: No; Manufacturer URL: http://www.ti.com/; Package Description: 14-Pin Small Outline Integrated Circuit, Body 8.65 x 3.9 mm, Pitch 1.27 mm; Operating Temperature Classification: Commercial; Datasheet URL: http://www.ti.com/lit/ds/symlink/lm324.pdf; Slew Rate: 0.5V/us; Package URL: http://www.ti.com/lit/ml/mpds177g/mpds177g.pdf; Mounting: SurfaceMount; Packaging: Rail/Tube; Mounting Technology: SurfaceMount; Operating Temp Range: 0Cto70C

## Sheet CAN.SchDoc
size B; SheetNumber: 3; SheetTotal: 6
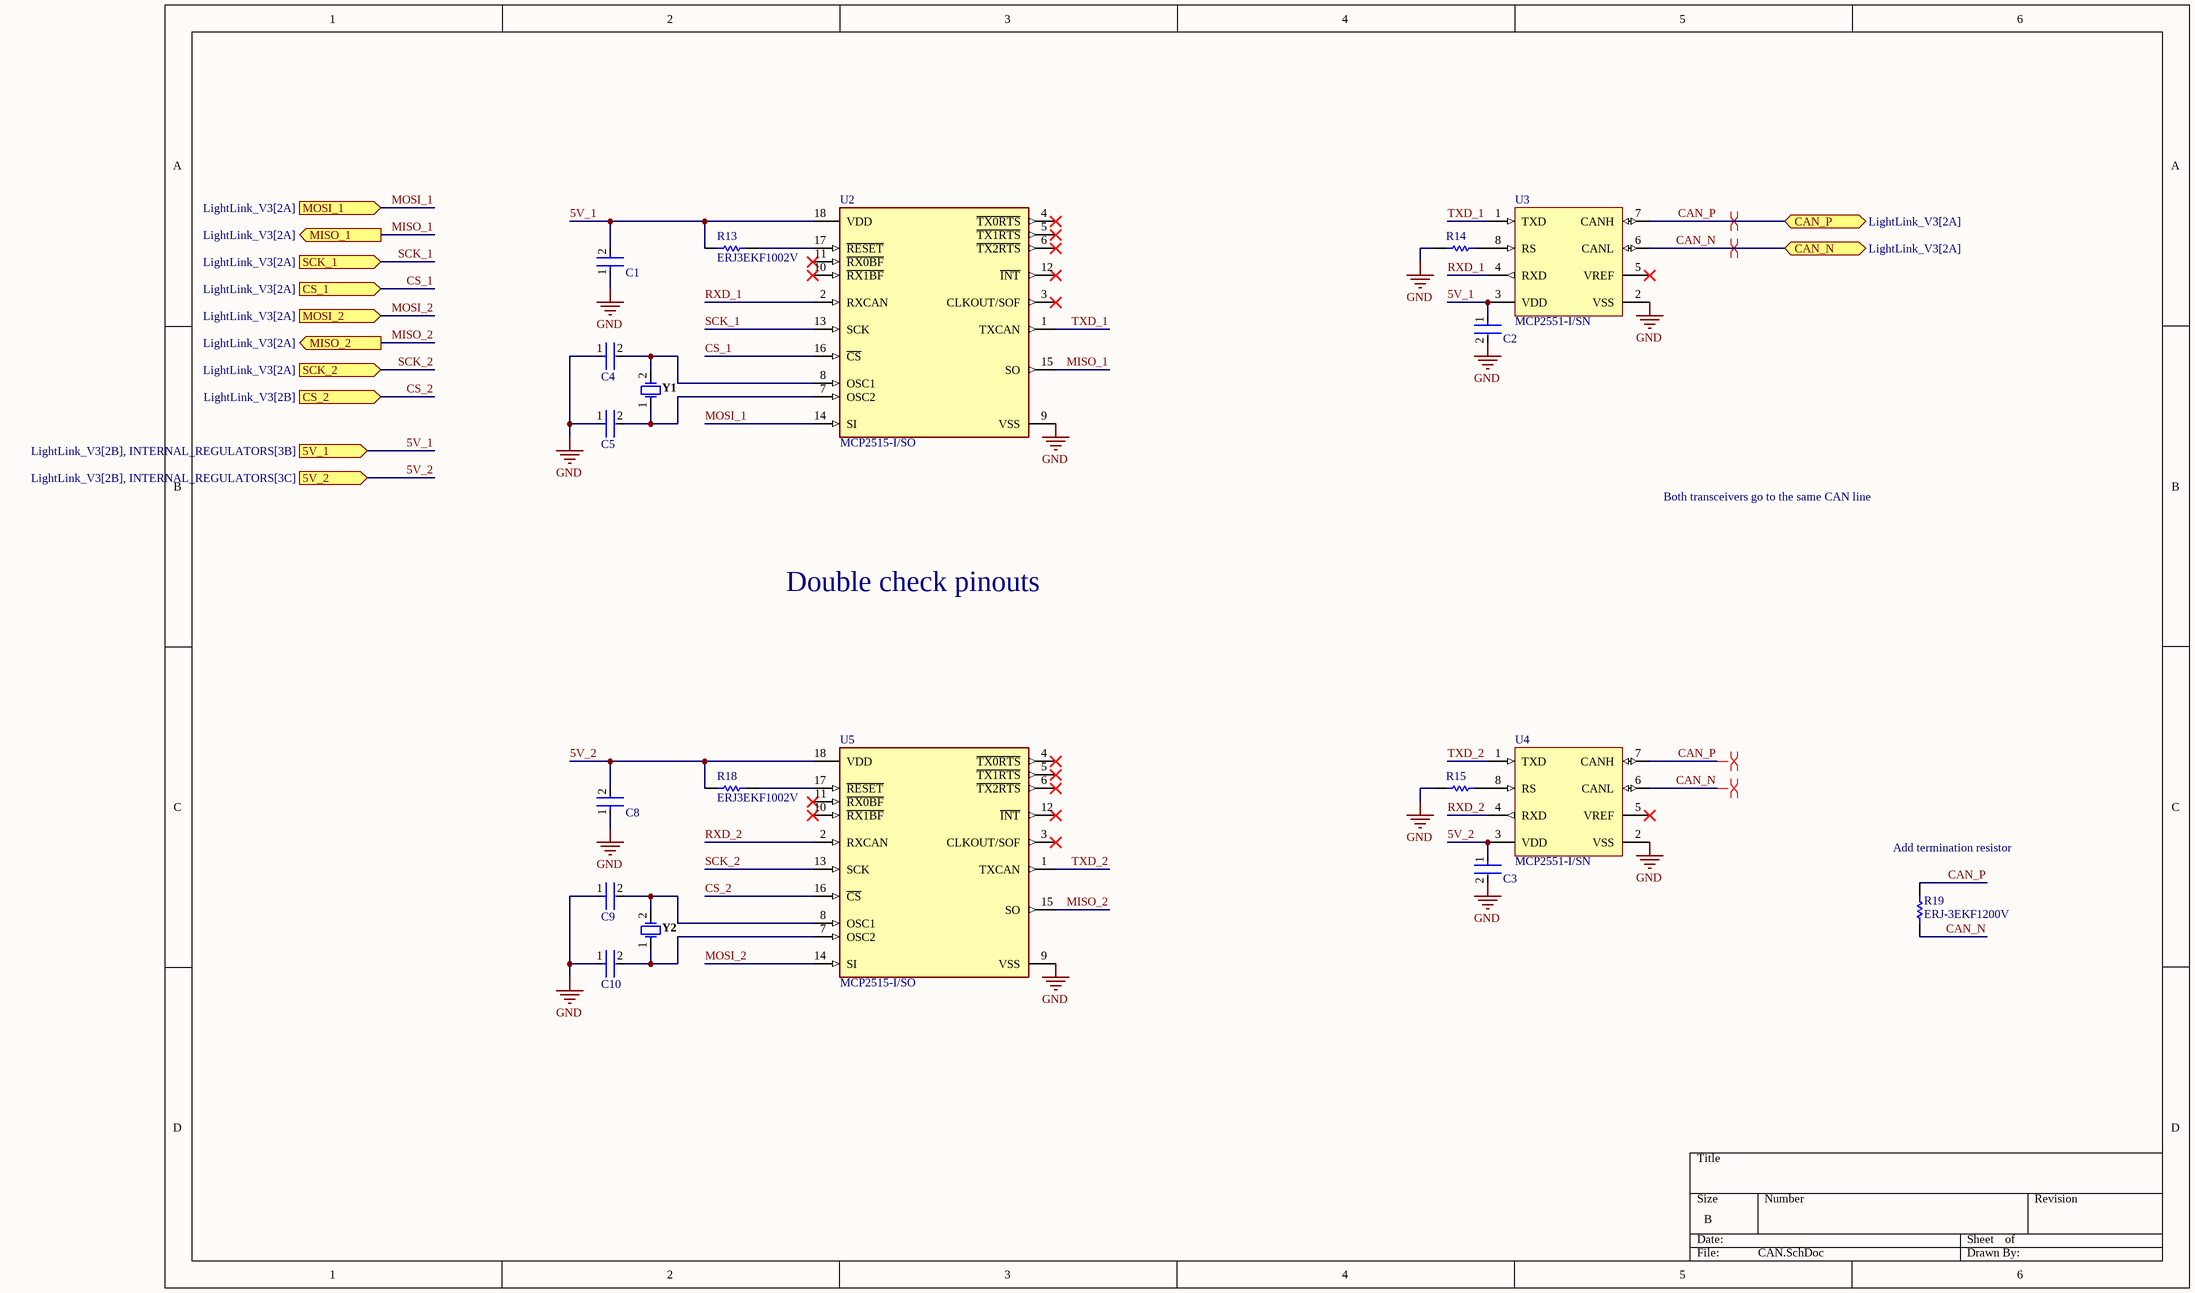
[diagram p2: CAN.SchDoc]

### Parts
C1  GRM188R60J106ME47D  [FP-GRM188-0_1-e0_2_0_55-IPC_A]  (value not drawn)
C2  C0402C104K8PACTU  [FP-C0402-BB-MFG]  (value not drawn)
C3  C0402C104K8PACTU  [FP-C0402-BB-MFG]  (value not drawn)
C4  GRM188R60J106ME47D  [FP-GRM188-0_1-e0_2_0_55-IPC_A]  (value not drawn)
C5  GRM188R60J106ME47D  [FP-GRM188-0_1-e0_2_0_55-IPC_A]  (value not drawn)
C8  GRM188R60J106ME47D  [FP-GRM188-0_1-e0_2_0_55-IPC_A]  (value not drawn)
C9  GRM188R60J106ME47D  [FP-GRM188-0_1-e0_2_0_55-IPC_A]  (value not drawn)
C10  GRM188R60J106ME47D  [FP-GRM188-0_1-e0_2_0_55-IPC_A]  (value not drawn)
R13  ERJ3EKF1002V  [RESC1609X55X30LL15T15]
R14  ERJ3EKF1002V  [RESC1609X55X30LL15T15]  (value not drawn)
R15  ERJ3EKF1002V  [RESC1609X55X30LL15T15]  (value not drawn)
R18  ERJ3EKF1002V  [RESC1609X55X30LL15T15]
R19  ERJ-3EKF1200V  [RESC1609X55X30ML15T15]
U2  MCP2515-I/SO  [FP-C04-051-MFG]
U3  MCP2551-I/SN  [MCHP-SN8_V]
U4  MCP2551-I/SN  [MCHP-SN8_V]
U5  MCP2515-I/SO  [FP-C04-051-MFG]
Y1  FOXSLF/160-20  [FOX-FOXSLF160-20]  (value not drawn)
Y2  FOXSLF/160-20  [FOX-FOXSLF160-20]  (value not drawn)

### Ports
5V_1 (in, see LightLink_V3[2B], INTERNAL_REGULATORS[3B]), 5V_2 (in, see LightLink_V3[2B], INTERNAL_REGULATORS[3C]), CAN_N (bidir, see LightLink_V3[2A]), CAN_P (bidir, see LightLink_V3[2A]), CS_1 (in, see LightLink_V3[2A]), CS_2 (in, see LightLink_V3[2B]), MISO_1 (out, see LightLink_V3[2A]), MISO_2 (out, see LightLink_V3[2A]), MOSI_1 (in, see LightLink_V3[2A]), MOSI_2 (in, see LightLink_V3[2A]), SCK_1 (in, see LightLink_V3[2A]), SCK_2 (in, see LightLink_V3[2A])

### Nets
GND: C1.1 C2.2 C3.2 C4.1 C5.1 C8.1 C9.1 C10.1 R14.1 R15.1 U2.9(VSS) U3.2(VSS) U4.2(VSS) U5.9(VSS)
5V_1: C1.2 C2.1 R13.1 U2.18(VDD) U3.3(VDD) ; port 5V_1
5V_2: C3.1 C8.2 R18.1 U4.3(VDD) U5.18(VDD) ; port 5V_2
CAN_N: R19.1 U3.6(CANL) U4.6(CANL) ; port CAN_N
CAN_P: R19.2 U3.7(CANH) U4.7(CANH) ; port CAN_P
CS_1: U2.16(~{CS}) ; port CS_1
CS_2: U5.16(~{CS}) ; port CS_2
MISO_1: U2.15(SO) ; port MISO_1
MISO_2: U5.15(SO) ; port MISO_2
MOSI_1: U2.14(SI) ; port MOSI_1
MOSI_2: U5.14(SI) ; port MOSI_2
RXD_1: U2.2(RXCAN) U3.4(RXD)
RXD_2: U4.4(RXD) U5.2(RXCAN)
SCK_1: U2.13(SCK) ; port SCK_1
SCK_2: U5.13(SCK) ; port SCK_2
TXD_1: U2.1(TXCAN) U3.1(TXD)
TXD_2: U4.1(TXD) U5.1(TXCAN)
NetC4_2: C4.2 U2.8(OSC1) Y1.2
NetC5_2: C5.2 U2.7(OSC2) Y1.1
NetC9_2: C9.2 U5.8(OSC1) Y2.2
NetC10_2: C10.2 U5.7(OSC2) Y2.1
NetR13_2: R13.2 U2.17(~{RESET})
NetR14_2: R14.2 U3.8(RS)
NetR15_2: R15.2 U4.8(RS)
NetR18_2: R18.2 U5.17(~{RESET})

Not connected (* = marked no-connect by the designer): U2 3(CLKOUT/SOF)* 4(~{TX0RTS})* 5(~{TX1RTS})* 6(~{TX2RTS})* 10(~{RX1BF})* 11(~{RX0BF})* 12(~{INT})*; U3 5(VREF)*; U4 5(VREF)*; U5 3(CLKOUT/SOF)* 4(~{TX0RTS})* 5(~{TX1RTS})* 6(~{TX2RTS})* 10(~{RX1BF})* 11(~{RX0BF})* 12(~{INT})*

### Layout directives
differential pair: CAN_N, CAN_P

### Notes on the sheet
- Both transceivers go to the same CAN line
- Double check pinouts
- (near R19) Add termination resistor

### Library data of the parts
C1 C4 C5 C8-C10 = CMP-2006-02792-2: Chip Multilayer Ceramic Capacitors for General Purpose, 0603, 10uF, X5R, 15%, 20%, 6.3V; Packaging: Tape and Reel; Voltage Rating (DC): 6.3V; Width: 0.031inch; Termination: SMD/SMT; Dielectric: X5R; Package Quantity: 4000; Voltage Rating: 6.3V; Capacitance: 10uF; Case/Package: 0603; Min Operating Temperature: -55°C; Voltage: 6.3V; Length: 1.6mm; Thickness: 0.035inch; Lead Free: Lead Free; Depth: 0.8mm; Case Code (Imperial): 0603; Max Operating Temperature: 85°C; Material: Ceramic; Height: 0.8mm; Tolerance: 20%; Mount: Surface Mount; REACH SVHC: No SVHC; Radiation Hardening: No; Case Code (Metric): 1608
C2 C3 = CMP-2008-02046-2: CAP CER 0.1UF 10V X5R 0402; Manufacturer: Kemet; Material: Ceramic; Capacitance: 0.10 μF; Temperature Coefficient: 15%; Tolerance: 0.1; Value: 0.10 μF; Package: C0402-BB; Temperature: -55°C to +125°C; ComponentLink2Description: Datasheet; Temperature Characteristic: X5R; Device Class L1: Passive Components; Height: 0.55mm; Lead Free: Yes; ComponentLink2URL: https://content.kemet.com/datasheets/KEM_C1002_X7R_SMD.pdf; Device Class L2: Capacitors; Temperature Range Low: -55°C; Temperature Range High: +125°C; RoHS: TRUE; Octopart: https://octopart.com/c0402c104k8pactu-kemet-140039; Automotive: No; Mouser Description: Capacitor 100 nF 10 VDC 0402; Category: Cap; Voltage Rating: 10 V; Digikey Description: CAP CER 0.1UF 10V X5R 0402; Ipc Land Pattern Name: CAPC10050X50; Device Class L3: Ceramic Capacitors; Manufacturer Part Number: C0402C104K8PACTU
R13-R15 R18 = CMP-1012-00623-3: as R11 on sheet LightLink_V3; Number of Pins: 2; Package Reference: 603; Depth: 0.8mm; Mount: SurfaceMount; Package Description: 2-Pin Surface Mount Device, Body 1.6 x 0.85 mm; Datasheet Version: 02/2017; Length: 1.6mm; Lead Free: LeadFree; Height: 0.45mm; Number of Terminations: 2; Max Power Dissipation: 100mW; Min Operating Temperature: -55degC; Datasheet URL: https://industrial.panasonic.com/cdbs/www-data/pdf/RDA0000/AOA0000C304.pdf; Termination: SMD/SMT; Case Code (Metric): 1608; Case Code (Imperial): 0603; Tolerance: 1%; Max Operating Temperature: 155degC; RoHSCompliant: true; Voltage Rating (DC): 75V; Radiation Hardening: No; Packaging: TapeandReel; Composition: ThickFilm; Mounting Technology: SurfaceMount; Manufacturer URL: http://www.panasonic.com/; Width: 0.031inch; REACH SVHC: NoSVHC; Contact Plating: Tin; Military Standard: Not; Package Quantity: 1
R19 = CMP-2000-00213-2: Chip Resistor, 120 Ohm, +/- 1%, 0.1 W, -55 to 155 degC, 0603 (1608 Metric), RoHS, Tape and Reel; Manufacturer: Panasonic; Power Rating: 100mW; Voltage Rating (DC): 75V; Resistance: 120Ohm; Temperature Coefficient: 100ppm/degreesC; Number of Terminations: 2; Military Standard: Not; Tolerance: 1%; Min Operating Temperature: -55degC; Packaging: TapeandReel; Lead Free: LeadFree; Max Operating Temperature: 155degC; Manufacturer URL: http://www.panasonic.com/; Case Code (Imperial): 0603; REACH SVHC: NoSVHC; Width: 0.031inch; Datasheet URL: https://industrial.panasonic.com/cdbs/www-data/pdf/RDA0000/AOA0000C283.pdf; RoHSCompliant: true; Max Power Dissipation: 100mW; Termination: SMD/SMT; Package Reference: 0603; Height: 0.022inch; Depth: 0.8mm; Package Description: 2-Pin Surface Mount Device, Body 1.6 x 0.85 mm; Contact Plating: Tin; Length: 1.6mm; Package URL: http://www.st.com/st-web-ui/static/active/en/resource/technical/document/datasheet/CD00001320.pdf; Radiation Hardening: No; Package Quantity: 1; Number of Pins: 2; Datasheet Version: 42095.0; Voltage Rating: 75V; Composition: ThickFilm; Case/Package: 0603; Mount: SurfaceMount; Case Code (Metric): 1608
U2 U5 = CMP-0186-00133-3: IC CAN CONTROLLER W/SPI 18SOIC; Manufacturer: Microchip; Min Supply Voltage: 2.7V; Max Supply Voltage: 5.5V; Standoff Height: 0.1mm; Nominal Supply Current: 10mA; Interface: SPI,CAN; Lead Free: Yes; Digikey Description: IC CAN CONTROLLER W/SPI 18SOIC; Category: IC; RoHS: TRUE; Manufacturer Part Number: MCP2515-I/SO; ComponentLink2URL: http://ww1.microchip.com/downloads/en/DeviceDoc/MCP2515-Stand-Alone-CAN-Controller-with-SPI-20001801J.pdf; Mouser Description: CAN Interface IC W/ SPI Interface; Device Class L2: Interface ICs; Package: C04-051; Automotive: No; Function: Controller; Octopart: https://octopart.com/mcp2515-i%2Fso-microchip-430187; Temperature: -40°C to +85°C; Ipc Land Pattern Name: SOIC127P1030X265-18; Ambient Temperature Range Low: -65°C; Height: 2.65mm; Device Class L1: Integrated Circuits (ICs); Ambient Temperature Range High: +125°C; Footprint Url: http://ww1.microchip.com/downloads/en/DeviceDoc/18L_SOIC_Wide_7.50_SO_C04-0051D.pdf; Temperature Range Low: -40°C; Device Class L3: Controllers; Temperature Range High: +85°C; ComponentLink2Description: Datasheet
U3 U4 = CMP-0186-00138-3: High-Speed CAN Transceiver, / 1 Mb/s, 4.5 to 5.5 V, 8-Pin SOIC (SN), Industrial Temperature, RoHS, Tube; Manufacturer: Microchip; RoHSCompliant: true; PackageReference: SN8; ComponentLink1URL: http://www.microchip.com/; DatasheetVersion: Rev. F, 07/2010; ComponentLink2Description: Datasheet; ComponentLink2URL: http://ww1.microchip.com/downloads/en/DeviceDoc/21667f.pdf; ComponentLink3Description: Package Specification; PackageDescription: 8-Pin Small Outline Integrated Circuit, Body 4.9 x 3.9 mm, Pitch 1.27 mm; ComponentLink1Description: Manufacturer URL; Mounting Technology: Surface Mount; ComponentLink3URL: http://www.microchip.com/stellent/groups/techpub_sg/documents/packagingspec/en012702.pdf
Y1 Y2 = CMP-1749-00003-1: Resistance Weld Thru-Hole Crystal, 16 MHz, -20 to 70 degC, 2-Pin THD, RoHS, Bulk; Voltage Rating: 250 V; Tolerance: 1%; Resistance: 221 kohm; Case\Package: Axial; Power Rating: 250 mW; RoHSCompliant: true; Package Quantity: 200; Packaging: Bulk; Min Operating Temperature: -55 degC; DatasheetVersion: Mar-15; ComponentLink1URL: http://www.foxonline.com/; Max Operating Temperature: 155 degC; PackageReference: FOXSLF160-20; Mount: Through Hole; PackageDescription: 2-Pin Through Hole Device, Body 11.35 x 4.65 mm; ComponentLink1Description: Manufacturer URL; ComponentLink2URL: http://www.foxonline.com/pdfs/hc49slf.pdf; ComponentLink2Description: Datasheet; Length: 0.248 inch

## Sheet INTERNAL_REGULATORS.SchDoc
size B; SheetNumber: 5; SheetTotal: 5
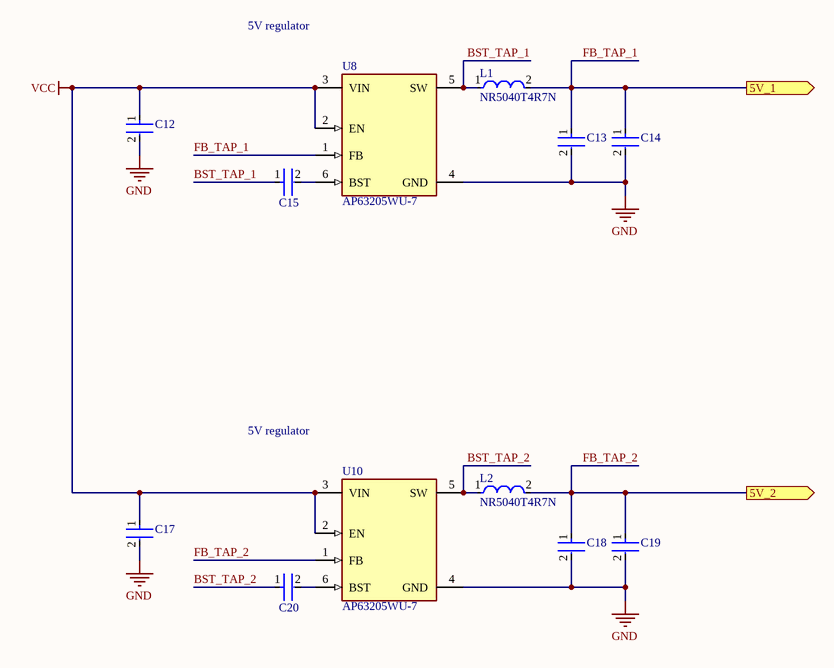
[diagram p3: INTERNAL_REGULATORS.SchDoc]

### Parts
C12  C0805C106K8PACTU  [FP-C0805C-DG-MFG]  (value not drawn)
C13  GRM21BR61E226ME44L  [FP-GRM21B-0_2-e0_2_0_7-IPC_B]  (value not drawn)
C14  GRM21BR61E226ME44L  [FP-GRM21B-0_2-e0_2_0_7-IPC_B]  (value not drawn)
C15  C0402C104K8PACTU  [FP-C0402-BB-MFG]  (value not drawn)
C17  C0805C106K8PACTU  [FP-C0805C-DG-MFG]  (value not drawn)
C18  GRM21BR61E226ME44L  [FP-GRM21B-0_2-e0_2_0_7-IPC_B]  (value not drawn)
C19  GRM21BR61E226ME44L  [FP-GRM21B-0_2-e0_2_0_7-IPC_B]  (value not drawn)
C20  C0402C104K8PACTU  [FP-C0402-BB-MFG]  (value not drawn)
L1  NR5040T4R7N  [FP-NR5040-H_4_1-MFG]
L2  NR5040T4R7N  [FP-NR5040-H_4_1-MFG]
U8  AP63205WU-7  [FP-TSOT26-MFG]
U10  AP63205WU-7  [FP-TSOT26-MFG]

### Ports
5V_1 (out), 5V_2 (out)

### Nets
GND: C12.2 C13.2 C14.2 C17.2 C18.2 C19.2 U8.4(GND) U10.4(GND)
VCC: C12.1 C17.1 U8.2(EN) U8.3(VIN) U10.2(EN) U10.3(VIN)
BST_TAP_1: C15.1 L1.1 U8.5(SW)
BST_TAP_2: C20.1 L2.1 U10.5(SW)
FB_TAP_1: C13.1 C14.1 L1.2 U8.1(FB) ; port 5V_1  [project net 5V_1]
FB_TAP_2: C18.1 C19.1 L2.2 U10.1(FB) ; port 5V_2  [project net 5V_2]
NetC15_2: C15.2 U8.6(BST)
NetC20_2: C20.2 U10.6(BST)

### Notes on the sheet
- 5V regulator

### Library data of the parts
C12 C17 = CMP-2007-03243-2: CAP CER 10UF 10V X5R 0805; Manufacturer: Kemet; 3DS Part Number: 220-00001; Tolerance: 10%; Temperature Coefficient: 15%; Material: Ceramic; Device Class L2: Capacitors; Device Class L1: Passive Components; ComponentLink2URL: https://content.kemet.com/datasheets/KEM_C1006_X5R_SMD.pdf; Height: 1.4mm; Lead Free: Yes; Manufacturer Part Number: C0805C106K8PACTU; Digikey Description: CAP CER 10UF 10V X5R 0805; Octopart: https://octopart.com/c0805c106k8pactu-kemet-98697; Capacitance: 10uF; Value: 10uF; Temperature Range Low: -55°C; Temperature: -55°C to +85°C; Automotive: No; Mouser Description: CAP CER 10UF 10V X5R 0805; Ipc Land Pattern Name: CAPC200125X125; Temperature Range High: +85°C; Voltage: 10V; RoHS: TRUE; Device Class L3: Ceramic Capacitors; ComponentLink2Description: Datasheet; Voltage Rating: 10V; Package: C0805C-DG; Temperature Characteristic: X5R; Category: Cap
C13 C14 C18 C19 = CMP-2007-03222-3: Chip Multilayer Ceramic Capacitors for General Purpose, 0805, 22uF, X5R, 15%, 20%, 25V; Case/Package: 0805; Depth: 1.25mm; Resistor Type: Ceramic; Voltage Rating: 25V; Lead Free: Lead Free; Voltage Rating (DC): 25V; Case Code (Metric): 2012; Thickness: 0.057inch; REACH SVHC: No SVHC; Material: Ceramic; Tolerance: 20%; Length: 2mm; Capacitance: 22uF; Case Code (Imperial): 0805; Max Operating Temperature: 85°C; Termination: SMD/SMT; Weight: 0.000335oz; Dielectric: X5R; Packaging: Tape and Reel; Voltage: 25V; Package Quantity: 3000; Height: 1.25mm; Mount: Surface Mount; Width: 1.25mm; Min Operating Temperature: -55°C
C15 C20 = CMP-2008-02046-2: as C2 on sheet CAN; Package: C0402-BB; Temperature: -55°C to +125°C; ComponentLink2Description: Datasheet; Temperature Characteristic: X5R; Device Class L1: Passive Components; Height: 0.55mm; Lead Free: Yes; ComponentLink2URL: https://content.kemet.com/datasheets/KEM_C1002_X7R_SMD.pdf; Device Class L2: Capacitors; Temperature Range Low: -55°C; Temperature Range High: +125°C; RoHS: TRUE; Octopart: https://octopart.com/c0402c104k8pactu-kemet-140039; Automotive: No; Mouser Description: Capacitor 100 nF 10 VDC 0402; Category: Cap; Voltage Rating: 10 V; Digikey Description: CAP CER 0.1UF 10V X5R 0402; Ipc Land Pattern Name: CAPC10050X50; Device Class L3: Ceramic Capacitors; Manufacturer Part Number: C0402C104K8PACTU
L1 L2 = CMP-14484-001014-1: SMD Power Inductors 4.7uH ±30% 3.1A 37.7mΩ; Test Frequency: 100kHz; Self Resonant Frequency: 28MHz; DC Resistance (DCR): 37.7mR; Saturation Current: 3.3A; Shielding: Shielded; Core Material: Ferrite; Package Quantity: 1500; RoHS Compliant: Yes; Resistor Type: Wirewound; Width: 4.9mm; Termination: SMD/SMT; Number of Pins: 2; Current Rating: 3.1A; Depth: 5.1mm; RMS Current (Irms): 3.1A; Height - Seated (Max): 0.161inch; Height: 4mm; Packaging: Tape and Reel; Inductance: 4.7uH; Length: 0.193inch; Max DC Current: 3.3A; Inductance Tolerance: 30%; Case/Package: Nonstandard; Series: NR; Min Operating Temperature: -25°C; Max Operating Temperature: 120°C; Mount: Surface Mount; Radiation Hardening: No; Tolerance: 30%; Halogen Free: Halogen Free
U8 U10 = CMP-12757-000001-1: IC REG BUCK 5V 2A TSOT26; Manufacturer: Diodes Inc.; Max Junction Temp: +160°C; Max Duty Cycle: 100%; Standoff Height: 0.01mm; Max Supply Voltage: 32V; Number Of Outputs: 1; Min Supply Voltage: 3.8V; Output Type: Fixed; Switching Frequency: 1100kHz; Nominal Supply Current: 22uA; Automotive: No; RoHS: TRUE; Switching Topology: Buck; Temperature: -40°C to +85°C; Footprint Url: https://www.diodes.com/assets/Package-Files/TSOT26.pdf; Lead Free: Yes; Digikey Description: IC REG BUCK 5V 2A TSOT26; Device Class L3: Voltage Regulators - Switching; Ambient Temperature Range High: +85°C; Category: IC; Package: TSOT26; Output Voltage: 5V; Output Current: 2A; ComponentLink2Description: Datasheet; Device Class L2: Power Management ICs; Ambient Temperature Range Low: -40°C; Temperature Range High: +85°C; Temperature Range Low: -40°C; Octopart: https://octopart.com/ap63205wu-7-diodes+inc.-98099551; Manufacturer Part Number: AP63205WU-7; Height: 1mm; Device Class L1: Integrated Circuits (ICs); ComponentLink2URL: https://www.diodes.com/assets/Datasheets/AP63200-AP63201-AP63203-AP63205.pdf

## Sheet CAN_SW.SchDoc
size A; SheetNumber: 6; SheetTotal: 6
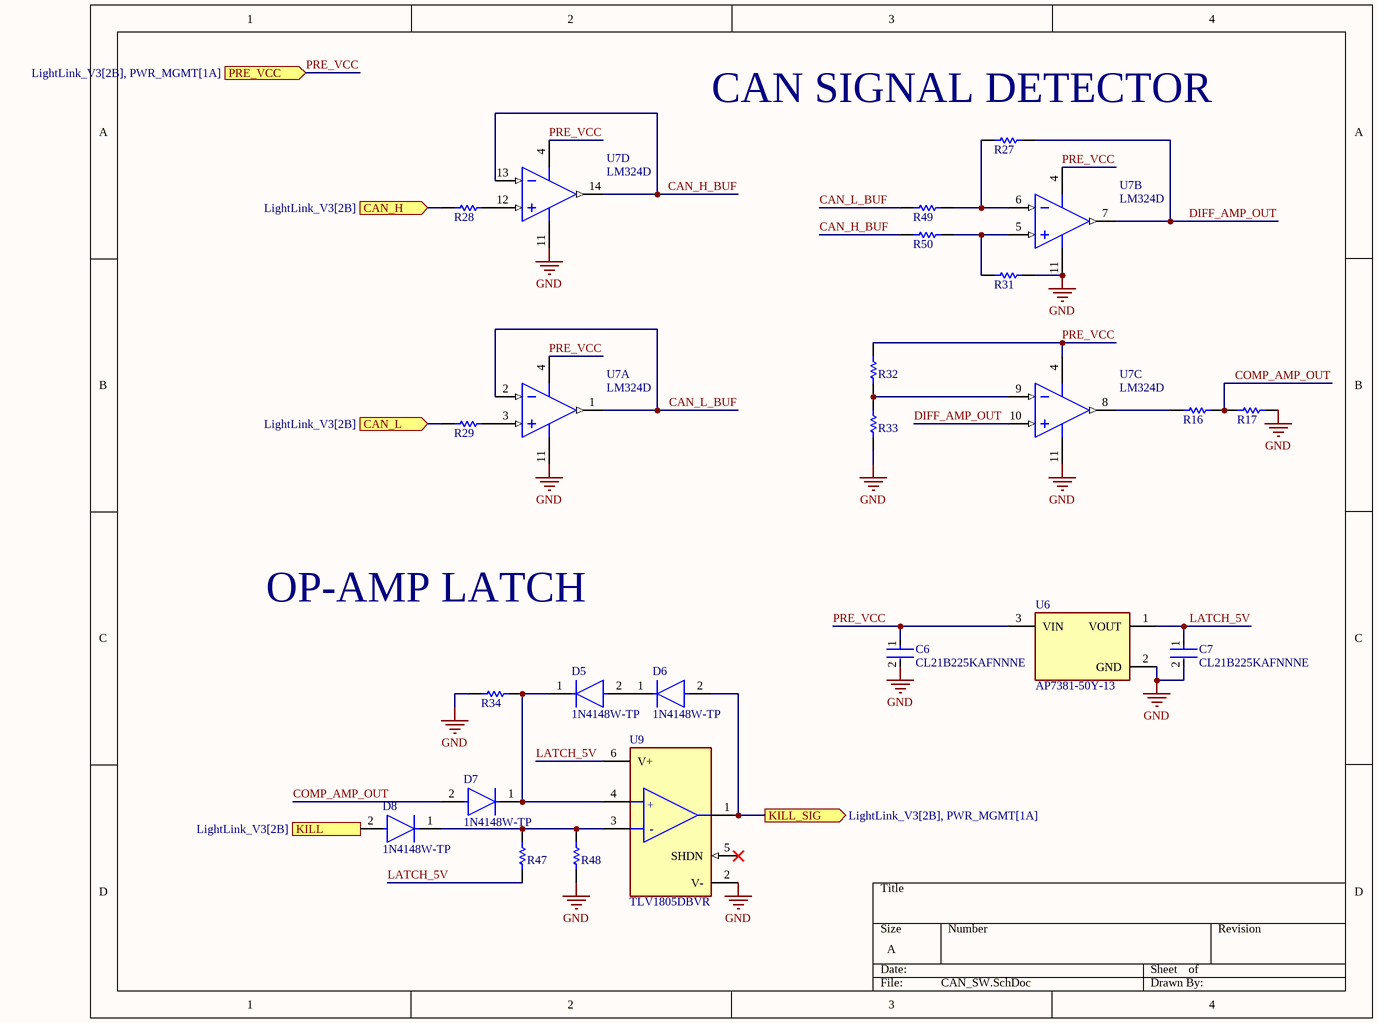
[diagram p4: CAN_SW.SchDoc]

### Parts
C6  CL21B225KAFNNNE  [FP-0805-L_2_01_0_2-W_1_25-IPC_B]
C7  CL21B225KAFNNNE  [FP-0805-L_2_01_0_2-W_1_25-IPC_B]
D5  1N4148W-TP  [FP-SOD-123-IPC_A]
D6  1N4148W-TP  [FP-SOD-123-IPC_A]
D7  1N4148W-TP  [FP-SOD-123-IPC_A]
D8  1N4148W-TP  [FP-SOD-123-IPC_A]
R16  ERJ3EKF1002V  [RESC1609X55X30LL15T15]  (value not drawn)
R17  ERJ3EKF1002V  [RESC1609X55X30LL15T15]  (value not drawn)
R27  ERJ3EKF1002V  [RESC1609X55X30LL15T15]  (value not drawn)
R28  ERJ3EKF1002V  [RESC1609X55X30LL15T15]  (value not drawn)
R29  ERJ3EKF1002V  [RESC1609X55X30LL15T15]  (value not drawn)
R31  ERJ3EKF1002V  [RESC1609X55X30LL15T15]  (value not drawn)
R32  ERJ3EKF1002V  [RESC1609X55X30LL15T15]  (value not drawn)
R33  ERJ-3EKF1001V  [RESC1608X55X30LL15T15]  (value not drawn)
R34  ERJ3EKF1002V  [RESC1609X55X30LL15T15]  (value not drawn)
R47  ERJ3EKF1002V  [RESC1609X55X30LL15T15]  (value not drawn)
R48  ERJ3EKF1002V  [RESC1609X55X30LL15T15]  (value not drawn)
R49  ERJ3EKF1002V  [RESC1609X55X30LL15T15]  (value not drawn)
R50  ERJ3EKF1002V  [RESC1609X55X30LL15T15]  (value not drawn)
U6  AP7381-50Y-13  [FP-SOT89-MFG]
U7  LM324D  [D0014A_L]  (parts A,B,C,D of 4)
U9  TLV1805DBVR  [FP-DBV0006A-IPC_C]

### Ports
CAN_H (in, see LightLink_V3[2B]), CAN_L (in, see LightLink_V3[2B]), KILL (in, see LightLink_V3[2B]), KILL_SIG (out, see LightLink_V3[2B], PWR_MGMT[1A]), PRE_VCC (in, see LightLink_V3[2B], PWR_MGMT[1A])

### Nets
GND: C6.2 C7.2 R17.1 R31.2 R33.1 R34.2 R48.1 U6.2(GND) U7.11(GND) U9.2(V-)
CAN_H_BUF: R50.1 U7.13(4IN-) U7.14(4OUT)
CAN_L_BUF: R49.1 U7.1(1OUT) U7.2(1IN-)
CAN_N: R29.1 ; port CAN_L
CAN_P: R28.1 ; port CAN_H
COMP_AMP_OUT: D7.2(A) R16.1 R17.2
D32: D8.2(A) ; port KILL
DIFF_AMP_OUT: R27.2 U7.7(2OUT) U7.10(3IN+)
KILL_SIG: D6.2(A) U9.1(OUT) ; port KILL_SIG
LATCH_5V: C7.1 R47.1 U6.1(VOUT) U9.6(V+)
PRE_VCC: C6.1 R32.2 U6.3(VIN) U7.4(VCC) ; port PRE_VCC
NetD5_1: D5.1(C) D7.1(C) R34.1 U9.4(+IN)
NetD5_2: D5.2(A) D6.1(C)
NetD8_1: D8.1(C) R47.2 R48.2 U9.3(-IN)
NetR16_2: R16.2 U7.8(3OUT)
NetR27_1: R27.1 R49.2 U7.6(2IN-)
NetR28_2: R28.2 U7.12(4IN+)
NetR29_2: R29.2 U7.3(1IN+)
NetR31_1: R31.1 R50.2 U7.5(2IN+)
NetR32_1: R32.1 R33.2 U7.9(3IN-)

Not connected (* = marked no-connect by the designer): U9 5(SHDN)*

### Notes on the sheet
- (near R27) CAN SIGNAL DETECTOR
- OP-AMP LATCH
- (in symbol CMP-04896-000098-1) +; -

### Library data of the parts
C6 C7 = CMP-2007-04514-2: Voltage Rating (DC): 25V; Tolerance: 10%; Capacitance: 2.2uF; Dielectric: X7R; RoHS Compliant: Yes; Lead Free: Lead Free; Packaging: Tape and Reel; Case Code (Imperial): 0805; Case/Package: 0805; Contact Plating: Tin; Mount: Surface Mount; Construction: Flat; Voltage: 25V; REACH SVHC: No SVHC; Thickness: 0.06inch; Depth: 1.25mm; Max Operating Temperature: 125°C; Package Quantity: 3000; Width: 0.049inch; Height: 1.52mm; Case Code (Metric): 2012; Number of Pins: 2; Termination: SMD/SMT; Voltage Rating: 25V; Radiation Hardening: No; Series: FlEXITERM; Length: 2.01mm; Min Operating Temperature: -55°C
D5-D8 = CMP-2000-04993-2: DIODE GEN PURP 100V 150MA SOD123; Max Reverse Leakage Current: 5uA; Max Surge Current: 2A; Reverse Recovery Time: 4ns; Polarity: Standard; Capacitance: 4pF; Max Forward Surge Current (Ifsm): 1A; Element Configuration: Single; Power Dissipation: 400mW; Forward Voltage: 1V; Radiation Hardening: No; Lead Free: Lead Free; Max Reverse Voltage (DC): 100V; Current Rating: 150mA; Forward Current: 150mA; Packaging: Tape and Reel; Number of Pins: 2; Package Quantity: 3000; Max Operating Temperature: 150°C; Min Operating Temperature: -65°C; Average Rectified Current: 150mA; Recovery Time: 4ns; Output Current: 150mA; Peak Non-Repetitive Surge Current: 2A; Width: 1.8mm; Voltage Rating (DC): 100V; Height: 1.2mm; Max Repetitive Reverse Voltage (Vrrm): 100V; Mount: Surface Mount; Length: 2.85mm
R16 R17 R27-R29 R31 R32 R34 R47-R50 = CMP-1012-00623-3: as R11 on sheet LightLink_V3; Number of Pins: 2; Package Reference: 603; Depth: 0.8mm; Mount: SurfaceMount; Package Description: 2-Pin Surface Mount Device, Body 1.6 x 0.85 mm; Datasheet Version: 02/2017; Length: 1.6mm; Lead Free: LeadFree; Height: 0.45mm; Number of Terminations: 2; Max Power Dissipation: 100mW; Min Operating Temperature: -55degC; Datasheet URL: https://industrial.panasonic.com/cdbs/www-data/pdf/RDA0000/AOA0000C304.pdf; Termination: SMD/SMT; Case Code (Metric): 1608; Case Code (Imperial): 0603; Tolerance: 1%; Max Operating Temperature: 155degC; RoHSCompliant: true; Voltage Rating (DC): 75V; Radiation Hardening: No; Packaging: TapeandReel; Composition: ThickFilm; Mounting Technology: SurfaceMount; Manufacturer URL: http://www.panasonic.com/; Width: 0.031inch; REACH SVHC: NoSVHC; Contact Plating: Tin; Military Standard: Not; Package Quantity: 1
R33 = CMP-2000-00180-1: Manufacturer: Panasonic; Part Number: ERJ-3EKF1001V
U6 = CMP-12756-000009-1: IC REG LINEAR 5V 150MA SOT89; Manufacturer: Diodes Inc.; Output Type: Fixed; Min Supply Voltage: 3.3V; Max Junction Temp: +125°C; Max Supply Voltage: 40V; Nominal Supply Current: 2.5-25uA; Number Of Outputs: 1; Dropout Voltage: 1000mV; Description: Linear Voltage Regulator IC  1 Output  150mA SOT-89; Manufacturer Part Number: AP7381-50Y-13; RoHS: TRUE; Digikey Description: IC REG LINEAR 5V 150MA SOT89; Output Voltage: 5V; Footprint Url: https://www.diodes.com/assets/Package-Files/SOT89.pdf; Category: IC; Temperature: -40°C to +125°C; ComponentLink2Description: Datasheet; Package: SOT89; Temperature Range Low: -40°C; Temperature Range High: +125°C; ComponentLink2URL: https://www.diodes.com/assets/Datasheets/AP7381.pdf; Device Class L1: Integrated Circuits (ICs); Automotive: No; Output Current: 150mA; Ambient Temperature Range High: +85°C; Octopart: https://octopart.com/ap7381-50y-13-diodes+inc.-87775116; Lead Free: Yes; Device Class L2: Power Management ICs; Height: 1.6mm; Device Class L3: Voltage Regulators - Linear; Ambient Temperature Range Low: -40°C
U7 = CMP-2000-06547-1: as U1 on sheet MOSFET; Datasheet Version: Rev. W, 03/2015; Technology: Bipolar; Shut Down Feature: No; Package Reference: D0014A; Type: GeneralPurposeAmplifier; Pin Count: 14; Package Type: SOIC; Rail/Rail I/O Type: No; Manufacturer URL: http://www.ti.com/; Package Description: 14-Pin Small Outline Integrated Circuit, Body 8.65 x 3.9 mm, Pitch 1.27 mm; Operating Temperature Classification: Commercial; Datasheet URL: http://www.ti.com/lit/ds/symlink/lm324.pdf; Slew Rate: 0.5V/us; Package URL: http://www.ti.com/lit/ml/mpds177g/mpds177g.pdf; Mounting: SurfaceMount; Packaging: Rail/Tube; Mounting Technology: SurfaceMount; Operating Temp Range: 0Cto70C
U9 = CMP-04896-000098-1: 40V, RAIL-TO-RAIL INPUT, PUSH-PU

## Nets that join several sheets
GND: LightLink_V3 (30 pins), M (10 pins), M (10 pins), M (10 pins), M (10 pins), M (10 pins), M (10 pins), M (10 pins), M (10 pins), M (10 pins), M (10 pins), M (10 pins), M (10 pins), CAN (14 pins), INTERNAL_REGULATORS (8 pins), CAN_SW (10 pins)
VCC: M (9 pins), M (9 pins), M (9 pins), M (9 pins), M (9 pins), M (9 pins), M (9 pins), M (9 pins), M (9 pins), M (9 pins), M (9 pins), M (9 pins), INTERNAL_REGULATORS (6 pins)
5V_1: LightLink_V3 (J2.01 J6.3 J6.4 R12.2), CAN (5 pins), INTERNAL_REGULATORS (C13.1 C14.1 L1.2 U8.1)
5V_2: LightLink_V3 (J3.01 J8.3 J8.4 R11.2), CAN (5 pins), INTERNAL_REGULATORS (C18.1 C19.1 L2.2 U10.1)
A0: LightLink_V3 (J7.10 J9.10), M (R53_M#12.1 R54_M#12.2)
A1: LightLink_V3 (J7.9 J9.9), M (R53_M#1.1 R54_M#1.2)
A2: LightLink_V3 (J7.12 J9.12), M (R53_M#11.1 R54_M#11.2)
A3: LightLink_V3 (J7.11 J9.11), M (R53_M#2.1 R54_M#2.2)
A4: LightLink_V3 (J7.14 J9.14), M (R53_M#10.1 R54_M#10.2)
A5: LightLink_V3 (J7.13 J9.13), M (R53_M#3.1 R54_M#3.2)
A6: LightLink_V3 (J7.16 J9.16), M (R53_M#9.1 R54_M#9.2)
A7: LightLink_V3 (J7.15 J9.15), M (R53_M#4.1 R54_M#4.2)
A8: LightLink_V3 (J7.18 J9.18), M (R53_M#8.1 R54_M#8.2)
A9: LightLink_V3 (J7.17 J9.17), M (R53_M#5.1 R54_M#5.2)
A10: LightLink_V3 (J7.20 J9.20), M (R53_M#7.1 R54_M#7.2)
A11: LightLink_V3 (J7.19 J9.19), M (R53_M#6.1 R54_M#6.2)
CAN_N: LightLink_V3 (J14.2), CAN (R19.1 U3.6 U4.6), CAN_SW (R29.1)
CAN_P: LightLink_V3 (J14.1), CAN (R19.2 U3.7 U4.7), CAN_SW (R28.1)
CS_1: LightLink_V3 (J7.36), CAN (U2.16)
CS_2: LightLink_V3 (J9.36), CAN (U5.16)
D3: LightLink_V3 (J6.11 J8.11), M (R51_M#10.1 R52_M#10.2)
D4: LightLink_V3 (J6.14 J8.14), M (R9_M#10.1 R10_M#10.2)
D5: LightLink_V3 (J6.13 J8.13), M (R51_M#9.1 R52_M#9.2)
D6: LightLink_V3 (J6.16 J8.16), M (R9_M#9.1 R10_M#9.2)
D7: LightLink_V3 (J6.15 J8.15), M (R51_M#8.1 R52_M#8.2)
D8: LightLink_V3 (J6.18 J8.18), M (R9_M#8.1 R10_M#8.2)
D9: LightLink_V3 (J6.17 J8.17), M (R51_M#7.1 R52_M#7.2)
D10: LightLink_V3 (J6.20 J8.20), M (R9_M#7.1 R10_M#7.2)
D11: LightLink_V3 (J6.19 J8.19), M (R51_M#6.1 R52_M#6.2)
D12: LightLink_V3 (J6.22 J8.22), M (R38_M#9.1)
D13: LightLink_V3 (J6.21 J8.21), M (R9_M#6.1 R10_M#6.2)
D14: LightLink_V3 (J6.24 J8.24), M (R51_M#5.1 R52_M#5.2)
D15: LightLink_V3 (J6.23 J8.23), M (R9_M#5.1 R10_M#5.2)
D16: LightLink_V3 (J6.26 J8.26), M (R51_M#4.1 R52_M#4.2)
D17: LightLink_V3 (J6.25 J8.25), M (R9_M#4.1 R10_M#4.2)
D18: LightLink_V3 (J6.28 J8.28), M (R51_M#3.1 R52_M#3.2)
D19: LightLink_V3 (J6.27 J8.27), M (R9_M#3.1 R10_M#3.2)
D20: LightLink_V3 (J6.30 J8.30), M (R51_M#2.1 R52_M#2.2)
D21: LightLink_V3 (J6.29 J8.29), M (R9_M#2.1 R10_M#2.2)
D22: LightLink_V3 (J6.32 J8.32), M (R51_M#1.1 R52_M#1.2)
D23: LightLink_V3 (J6.31 J8.31), M (R9_M#1.1 R10_M#1.2)
D24: LightLink_V3 (J6.34 J8.34), M (R38_M#8.1)
D25: LightLink_V3 (J6.33 J8.33), M (R38_M#5.1)
D26: LightLink_V3 (J6.36 J8.36), M (R38_M#7.1)
D27: LightLink_V3 (J6.35 J8.35), M (R38_M#6.1)
D28: LightLink_V3 (J6.38 J8.38), M (R38_M#4.1)
D29: LightLink_V3 (J6.37 J8.37), M (R38_M#1.1)
D30: LightLink_V3 (J6.40 J8.40), M (R38_M#3.1)
D31: LightLink_V3 (J6.39 J8.39), M (R38_M#2.1)
D32: LightLink_V3 (J7.26 J9.26), CAN_SW (D8.2)
D38: LightLink_V3 (J7.32 J9.32), M (R51_M#12.1 R52_M#12.2)
D40: LightLink_V3 (J7.34 J9.34), M (R9_M#12.1 R10_M#12.2)
D41: LightLink_V3 (J7.33 J9.33), M (R51_M#11.1 R52_M#11.2)
D43: LightLink_V3 (J7.35 J9.35), M (R9_M#11.1 R10_M#11.2)
D44: LightLink_V3 (J7.38 J9.38), M (R38_M#12.1)
D45: LightLink_V3 (J7.37 J9.37), M (R38_M#10.1)
D46: LightLink_V3 (J7.40 J9.40), M (R38_M#11.1)
MISO_1: LightLink_V3 (J2.02), CAN (U2.15)
MISO_2: LightLink_V3 (J3.02), CAN (U5.15)
MOSI_1: LightLink_V3 (J2.03), CAN (U2.14)
MOSI_2: LightLink_V3 (J3.03), CAN (U5.14)
OUT_1: LightLink_V3 (J4.8), M (R2_M#1.2 R6_M#1.2)
OUT_2: LightLink_V3 (J4.7), M (R2_M#2.2 R6_M#2.2)
OUT_3: LightLink_V3 (J4.6), M (R2_M#3.2 R6_M#3.2)
OUT_4: LightLink_V3 (J4.5), M (R2_M#4.2 R6_M#4.2)
OUT_5: LightLink_V3 (J11.8), M (R2_M#5.2 R6_M#5.2)
OUT_6: LightLink_V3 (J11.7), M (R2_M#6.2 R6_M#6.2)
OUT_7: LightLink_V3 (J11.6), M (R2_M#7.2 R6_M#7.2)
OUT_8: LightLink_V3 (J11.5), M (R2_M#8.2 R6_M#8.2)
OUT_9: LightLink_V3 (J13.8), M (R2_M#9.2 R6_M#9.2)
OUT_10: LightLink_V3 (J13.7), M (R2_M#10.2 R6_M#10.2)
OUT_11: LightLink_V3 (J13.6), M (R2_M#11.2 R6_M#11.2)
OUT_12: LightLink_V3 (J13.5), M (R2_M#12.2 R6_M#12.2)
SCK_1: LightLink_V3 (J2.04), CAN (U2.13)
SCK_2: LightLink_V3 (J3.04), CAN (U5.13)